# EAGLE design eps-v1-1 (EAGLE 6.1)
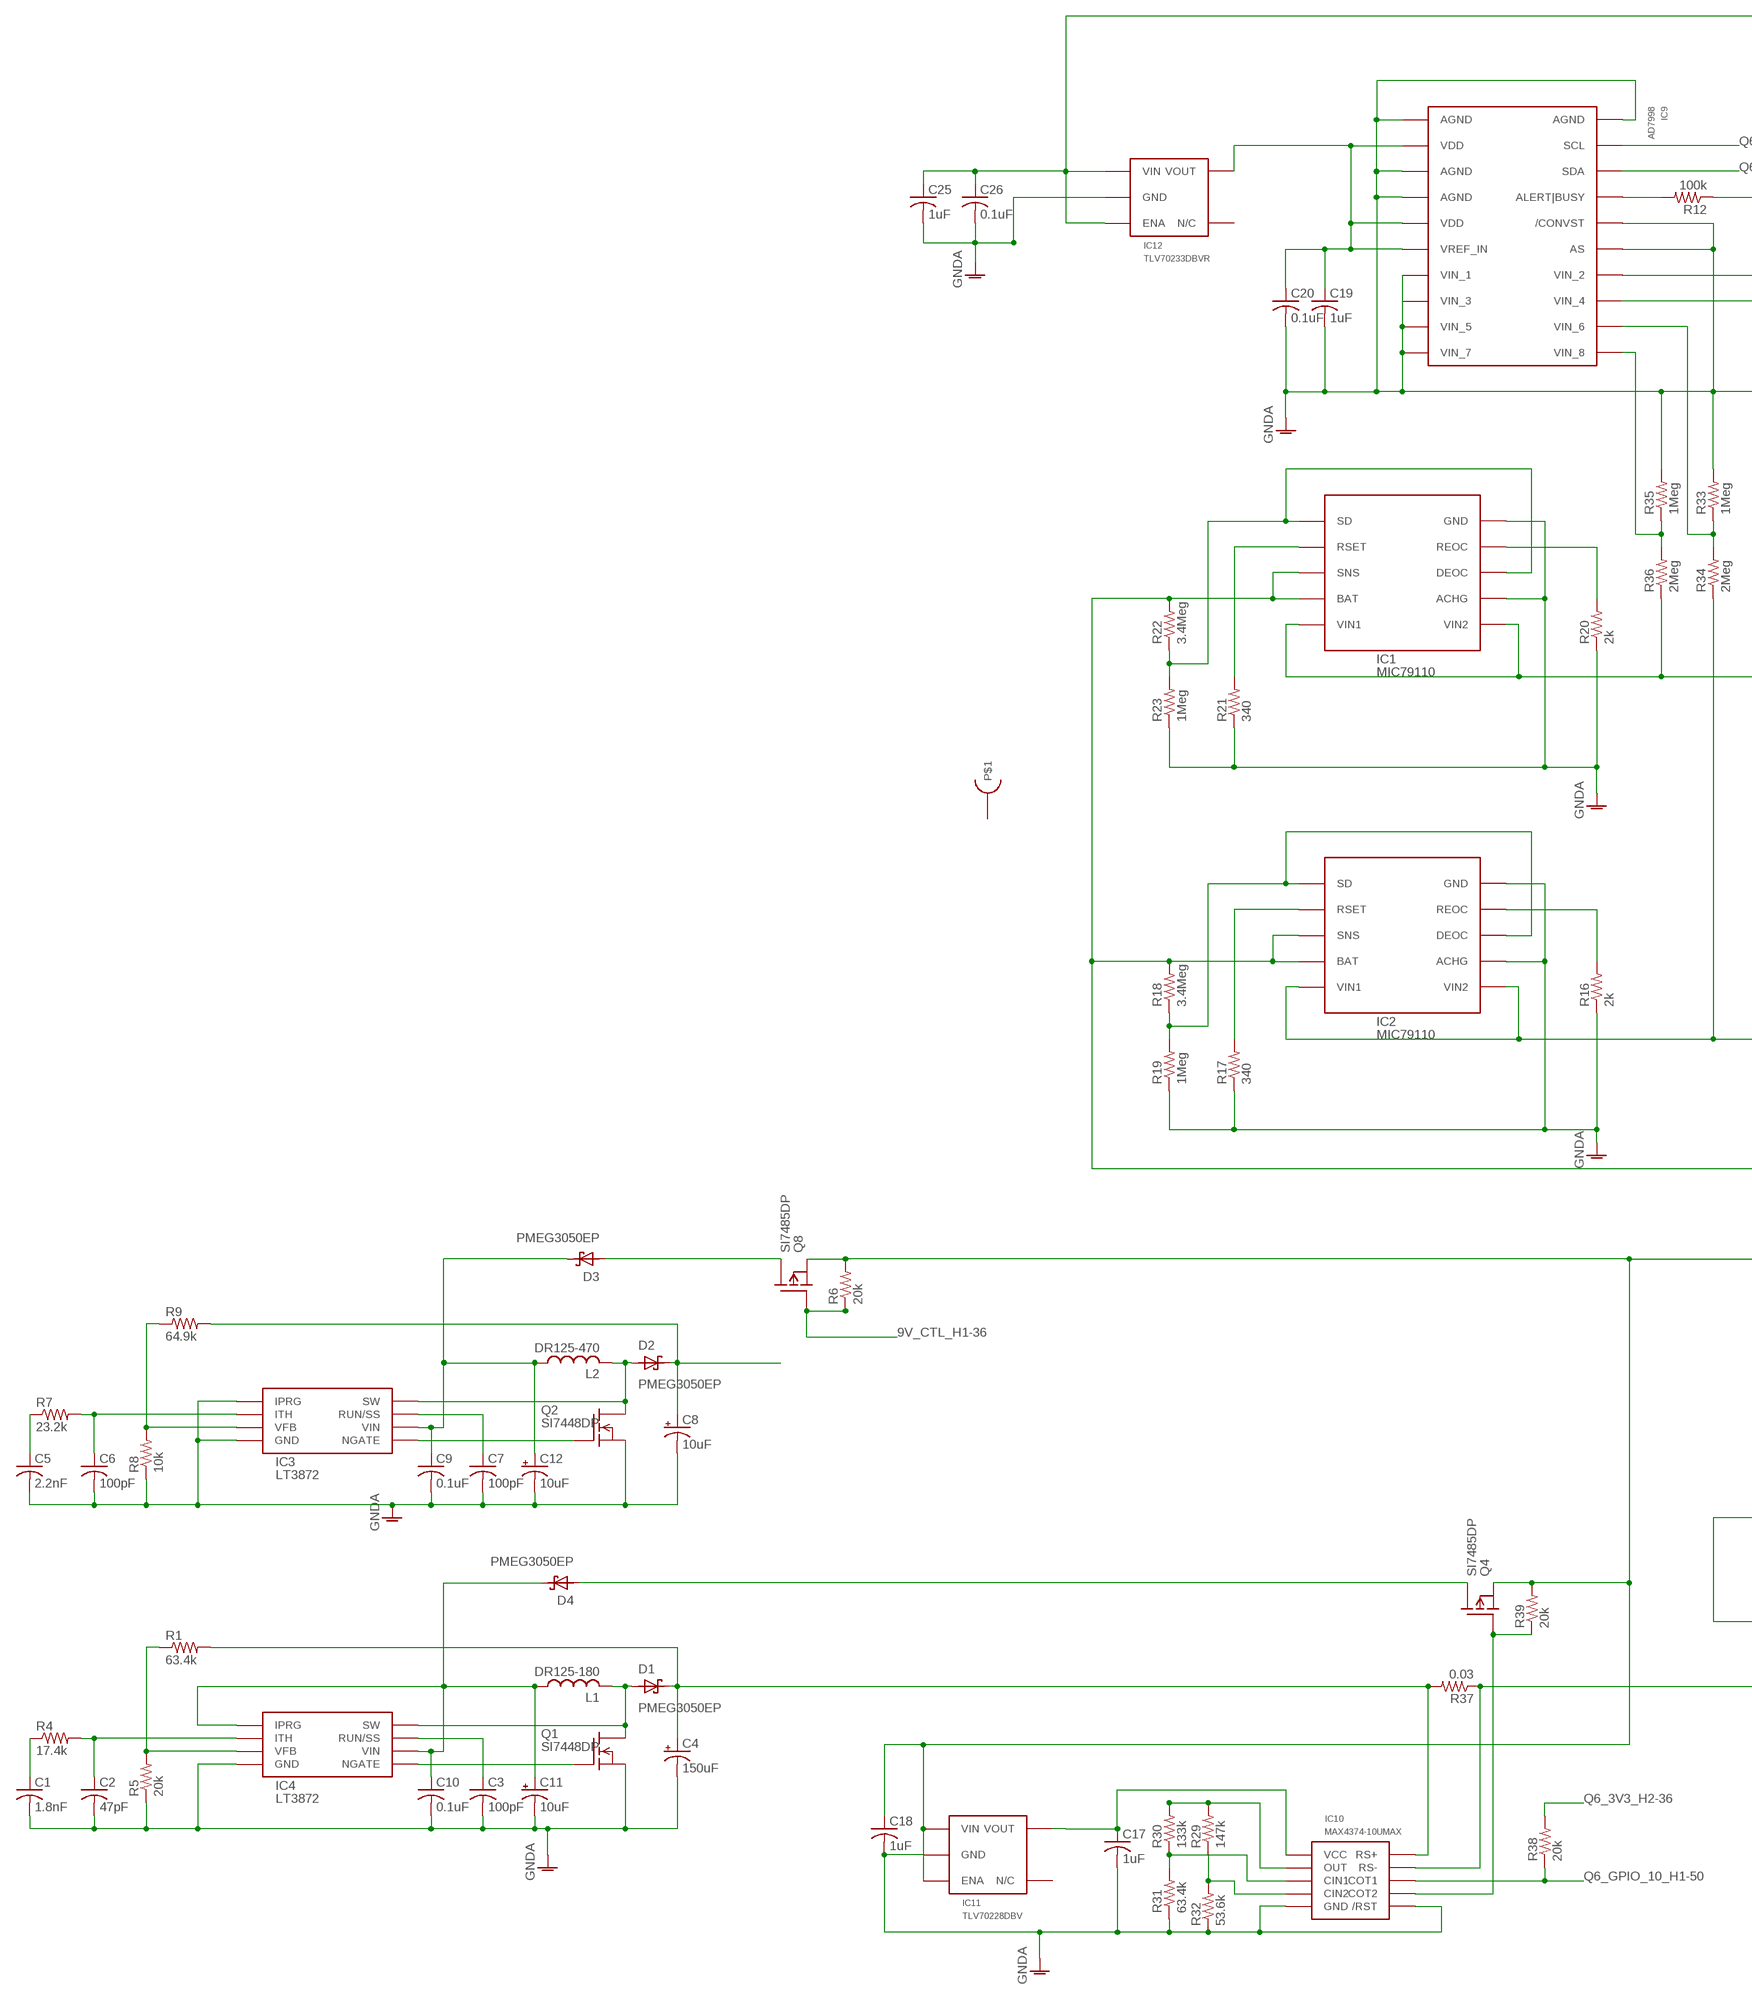
[diagram p0: schematic, sheet 1, part 1 of 2]
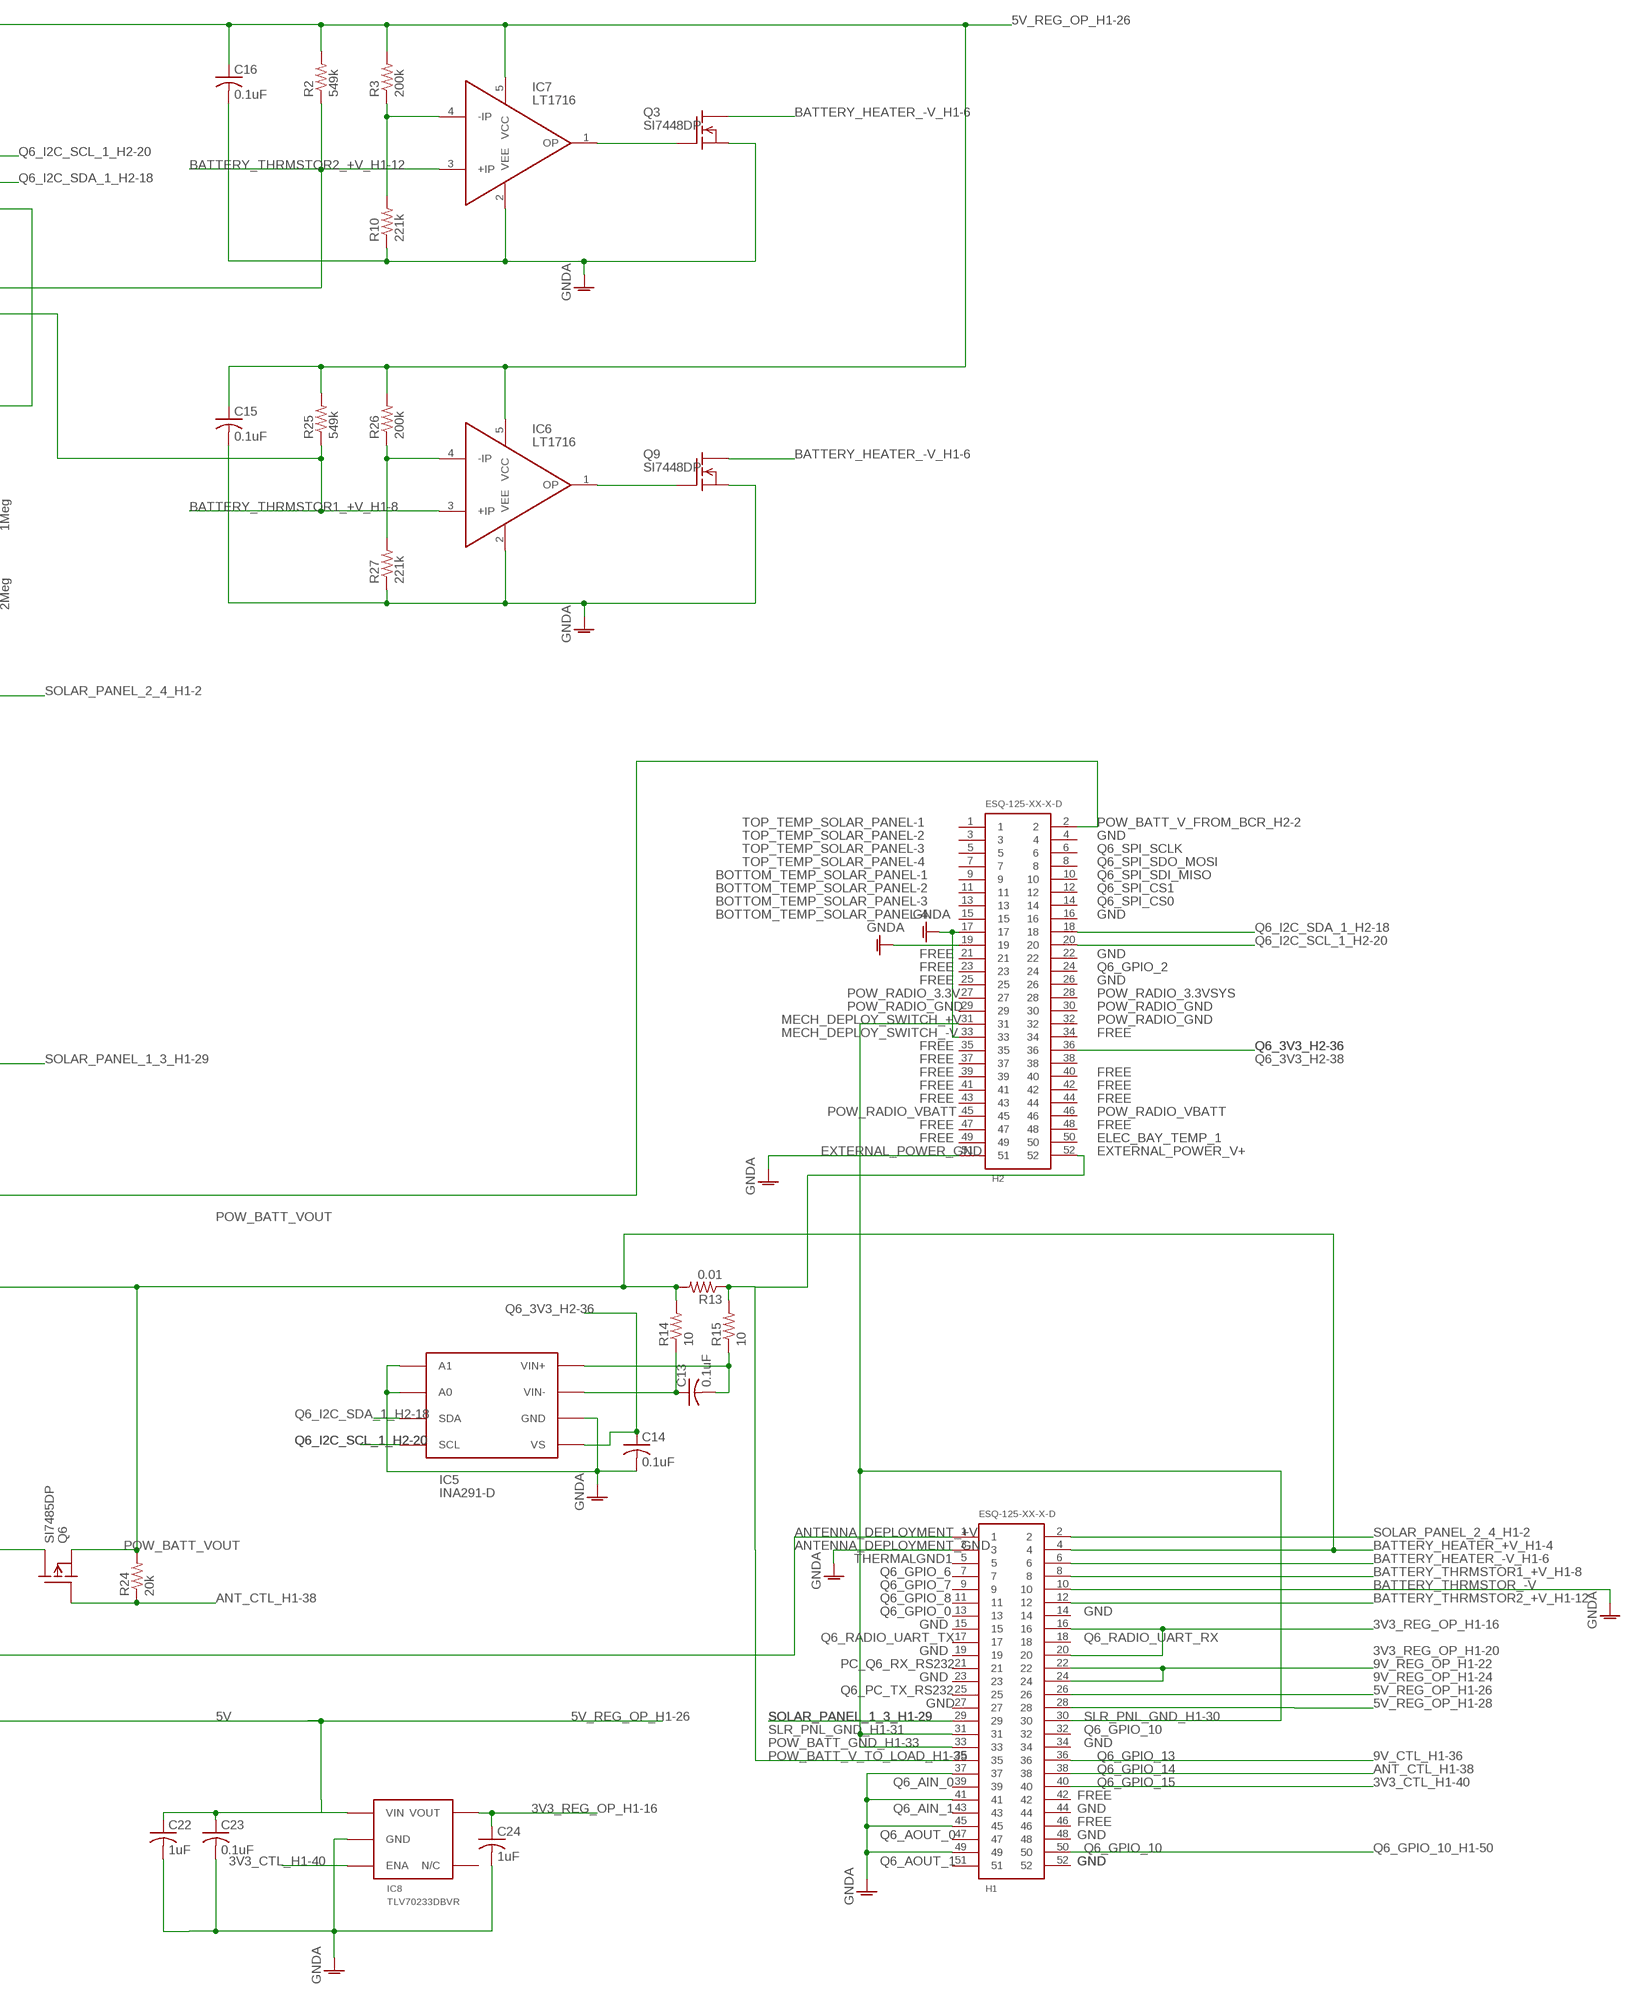
[diagram p1: schematic, sheet 1, part 2 of 2]

## Parts
C1  1.8nF  C-USC0805  [C0805]
C2  47pF  C-USC0805  [C0805]
C3  100pF  C-USC0805  [C0805]
C4  150uF  CPOL-USD/7343-31R  [D/7343-31R]
C5  2.2nF  C-USC0805  [C0805]
C6  100pF  C-USC0805  [C0805]
C7  100pF  C-USC0805  [C0805]
C8  10uF  CPOL-USD/7343-31R  [D/7343-31R]
C9  0.1uF  C-USC0805  [C0805]
C10  0.1uF  C-USC0805  [C0805]
C11  10uF  CPOL-USD/7343-31R  [D/7343-31R]
C12  10uF  CPOL-USD/7343-31R  [D/7343-31R]
C13  0.1uF  C-USC0805  [C0805]
C14  0.1uF  C-USC0805  [C0805]
C15  0.1uF  C-USC0805  [C0805]
C16  0.1uF  C-USC0805  [C0805]
C17  1uF  C-USC0805  [C0805]
C18  1uF  C-USC0805  [C0805]
C19  1uF  C-USC0805  [C0805]
C20  0.1uF  C-USC0805  [C0805]
C22  1uF  C-USC0805  [C0805]
C23  0.1uF  C-USC0805  [C0805]
C24  1uF  C-USC0805  [C0805]
C25  1uF  C-USC0805  [C0805]
C26  0.1uF  C-USC0805  [C0805]
D1  PMEG3050EP  [SOD128]
D2  PMEG3050EP  [SOD128]
D3  PMEG3050EP  [SOD128]
D4  PMEG3050EP  [SOD128]
H1  ESQ-125-XX-X-D  [ESQ-125-XX-X-D]
H2  ESQ-125-XX-X-D  [ESQ-125-XX-X-D]
IC1  MIC79110  [MLF10-EP]
IC2  MIC79110  [MLF10-EP]
IC3  LT3872  [TSOT23-8]
IC4  LT3872  [TSOT23-8]
IC5  INA291-D  [SO08]
IC6  LT1716  [SOT23-5]
IC7  LT1716  [SOT23-5]
IC8  TLV70233DBVR  [SOT23-5]
IC9  AD7998  [TSSOP-20]
IC10  MAX4374-10UMAX  [10UMAX]
IC11  TLV70228DBV  [SOT23-5]
IC12  TLV70233DBVR  [SOT23-5]
L1  DR125-180  [DR125]
L2  DR125-470  [DR125]
Q1  SI7448DP  [PPAK-SO08-EP]
Q2  SI7448DP  [PPAK-SO08-EP]
Q3  SI7448DP  [PPAK-SO08-EP]
Q4  SI7485DP  [PPAK-SO08-EP]
Q6  SI7485DP  [PPAK-SO08-EP]
Q8  SI7485DP  [PPAK-SO08-EP]
Q9  SI7448DP  [PPAK-SO08-EP]
R1  63.4k  R-US_M1206  [M1206]
R2  549k  R-US_M1206  [M1206]
R3  200k  R-US_M1206  [M1206]
R4  17.4k  R-US_M1206  [M1206]
R5  20k  R-US_M1206  [M1206]
R6  20k  R-US_M1206  [M1206]
R7  23.2k  R-US_M1206  [M1206]
R8  10k  R-US_M1206  [M1206]
R9  64.9k  R-US_M1206  [M1206]
R10  221k  R-US_M1206  [M1206]
R12  100k  R-US_M1206  [M1206]
R13  0.01  R-US_M1206  [M1206]
R14  10  R-US_M1206  [M1206]
R15  10  R-US_M1206  [M1206]
R16  2k  R-US_M1206  [M1206]
R17  340  R-US_M1206  [M1206]
R18  3.4Meg  R-US_M1206  [M1206]
R19  1Meg  R-US_M1206  [M1206]
R20  2k  R-US_M1206  [M1206]
R21  340  R-US_M1206  [M1206]
R22  3.4Meg  R-US_M1206  [M1206]
R23  1Meg  R-US_M1206  [M1206]
R24  20k  R-US_M1206  [M1206]
R25  549k  R-US_M1206  [M1206]
R26  200k  R-US_M1206  [M1206]
R27  221k  R-US_M1206  [M1206]
R29  147k  R-US_M1206  [M1206]
R30  133k  R-US_M1206  [M1206]
R31  63.4k  R-US_M1206  [M1206]
R32  53.6k  R-US_M1206  [M1206]
R33  1Meg  R-US_M1206  [M1206]
R34  2Meg  R-US_M1206  [M1206]
R35  1Meg  R-US_M1206  [M1206]
R36  2Meg  R-US_M1206  [M1206]
R37  0.03  R-US_M1206  [M1206]
R38  20k  R-US_M1206  [M1206]
R39  20k  R-US_M1206  [M1206]
U$1  EPS_PCB_THRM_PAD  [EPS_PCB_THRM_PAD]

## Nets
3V3_CTL_H1-40: H1.40 IC8.3(ENA)
3V3_REG_OP_H1-16: C24.1 H1.16 H1.20 IC8.5(VOUT)
5V_REG_OP_H1-26: C15.1 C16.1 C22.1 C23.1 C25.1 C26.1 H1.26 H1.28 IC6.5(VCC) IC7.5(VCC) IC8.1(VIN) IC10.P$9(RS-) IC12.1(VIN) IC12.3(ENA) R2.2 R3.2 R25.2 R26.2 R37.1
9V_CTL_H1-36: H1.36 Q8.P$4-G(G) R6.1
9V_REG_OP_H1-22: C8.+ D2.P$1-CATHODE H1.22 H1.24 R9.2
ANT_CTL_H1-38: H1.38 Q6.P$4-G(G) R24.1
BATTERY_HEATER_-V_H1-6: H1.6 Q3.P$5-D(D) Q3.P$6-D(D) Q3.P$7-D(D) Q3.P$8-D(D) Q3.P$9-D(D) Q3.P$10-D(D) Q3.P$11-D(D) Q9.P$5-D(D) Q9.P$6-D(D) Q9.P$7-D(D) Q9.P$8-D(D) Q9.P$9-D(D) Q9.P$10-D(D) Q9.P$11-D(D)
BATTERY_THRMSTOR1_+V_H1-8: H1.8 IC6.3(+IP) IC9.P$13(VIN_4) R25.1
BATTERY_THRMSTOR2_+V_H1-12: H1.12 IC7.3(+IP) IC9.P$14(VIN_2) R2.1
GNDA: C1.2 C2.2 C3.2 C4.- C5.2 C6.2 C7.2 C8.- C9.2 C10.2 C11.- C12.- C14.2 C15.2 C16.2 C17.2 C18.2 C19.2 C20.2 C22.2 C23.2 C24.2 C25.2 C26.2 H1.3 H1.10 H1.37 H1.41 H1.45 H1.49 H2.17 H2.19 H2.33 H2.51 IC1.P$7(ACHG) IC1.P$10(GND) IC2.P$7(ACHG) IC2.P$10(GND) IC3.P$1(IPRG) IC3.P$4(GND) IC4.P$4(GND) IC5.1(A1) IC5.2(A0) IC5.6(GND) IC6.2(VEE) IC7.2(VEE) IC8.2(GND) IC9.P$1(AGND) IC9.P$3(AGND) IC9.P$4(AGND) IC9.P$7(VIN_1) IC9.P$8(VIN_3) IC9.P$9(VIN_5) IC9.P$10(VIN_7) IC9.P$15(AS) IC9.P$16(/CONVST) IC9.P$20(AGND) IC10.P$5(GND) IC10.P$6(/RST) IC11.2(GND) IC12.2(GND) Q1.P$1-S(S) Q1.P$2-S(S) Q1.P$3-S(S) Q2.P$1-S(S) Q2.P$2-S(S) Q2.P$3-S(S) Q3.P$1-S(S) Q3.P$2-S(S) Q3.P$3-S(S) Q9.P$1-S(S) Q9.P$2-S(S) Q9.P$3-S(S) R5.1 R8.1 R10.1 R12.1 R16.1 R17.1 R19.1 R20.1 R21.1 R23.1 R27.1 R31.1 R32.1 R33.2 R35.2
N$1: IC4.P$5(NGATE) Q1.P$4-G(G)
N$2: H2.2 IC1.P$3(SNS) IC1.P$4(BAT) IC2.P$3(SNS) IC2.P$4(BAT) R18.2 R22.2
N$3: C10.1 C11.+ D4.P$1-CATHODE IC4.P$1(IPRG) IC4.P$6(VIN) L1.P$1
N$7: IC4.P$3(VFB) R1.1 R5.2
N$8: C1.1 R4.1
N$9: C2.1 IC4.P$2(ITH) R4.2
N$10: D1.P$2-ANODE IC4.P$8(SW) L1.P$2 Q1.P$5-D(D) Q1.P$6-D(D) Q1.P$7-D(D) Q1.P$8-D(D) Q1.P$9-D(D) Q1.P$10-D(D) Q1.P$11-D(D)
N$12: H1.1 Q6.P$5-D(D) Q6.P$6-D(D) Q6.P$7-D(D) Q6.P$8-D(D) Q6.P$9-D(D) Q6.P$10-D(D) Q6.P$11-D(D)
N$14: D2.P$2-ANODE IC3.P$8(SW) L2.P$2 Q2.P$5-D(D) Q2.P$6-D(D) Q2.P$7-D(D) Q2.P$8-D(D) Q2.P$9-D(D) Q2.P$10-D(D) Q2.P$11-D(D)
N$16: IC3.P$5(NGATE) Q2.P$4-G(G)
N$17: C7.1 IC3.P$7(RUN/SS)
N$18: C19.1 C20.1 IC9.P$2(VDD) IC9.P$5(VDD) IC9.P$6(VREF_IN) IC12.5(VOUT)
N$19: IC3.P$3(VFB) R8.2 R9.1
N$20: C5.1 R7.1
N$21: C6.1 IC3.P$2(ITH) R7.2
N$22: H1.30 H1.31 H1.33 H2.31
N$23: C9.1 C12.+ D3.P$1-CATHODE IC3.P$6(VIN) L2.P$1
N$24: IC9.P$11(VIN_8) R35.1 R36.2
N$25: IC2.P$2(RSET) R17.2
N$26: D3.P$2-ANODE Q8.P$5-D(D) Q8.P$6-D(D) Q8.P$7-D(D) Q8.P$8-D(D) Q8.P$9-D(D) Q8.P$10-D(D) Q8.P$11-D(D)
N$27: IC2.P$1(SD) IC2.P$8(DEOC) R18.1 R19.2
N$28: IC2.P$9(REOC) R16.2
N$29: IC1.P$2(RSET) R21.2
N$30: C4.+ D1.P$1-CATHODE IC10.P$10(RS+) R1.2 R37.2
N$31: IC1.P$1(SD) IC1.P$8(DEOC) R22.1 R23.2
N$32: IC1.P$9(REOC) R20.2
N$33: IC7.1(OP) Q3.P$4-G(G)
N$35: IC7.4(-IP) R3.1 R10.2
N$37: IC9.P$12(VIN_6) R33.1 R34.2
N$38: C13.2 IC5.8(VIN+) R15.1
N$39: D4.P$2-ANODE Q4.P$5-D(D) Q4.P$6-D(D) Q4.P$7-D(D) Q4.P$8-D(D) Q4.P$9-D(D) Q4.P$10-D(D) Q4.P$11-D(D)
N$40: C13.1 IC5.7(VIN-) R14.1
N$43: C18.1 H1.4 IC11.1(VIN) IC11.3(ENA) Q4.P$1-S(S) Q4.P$2-S(S) Q4.P$3-S(S) Q6.P$1-S(S) Q6.P$2-S(S) Q6.P$3-S(S) Q8.P$1-S(S) Q8.P$2-S(S) Q8.P$3-S(S) R6.2 R13.2 R14.2 R24.2 R39.2
N$45: IC6.1(OP) Q9.P$4-G(G)
N$46: H1.35 H2.52 R13.1 R15.2
N$47: C17.1 IC10.P$1(VCC) IC11.5(VOUT)
N$48: IC9.P$17(ALERT|BUSY) R12.2
N$51: IC10.P$2(OUT) R29.2 R30.2
N$53: IC6.4(-IP) R26.1 R27.2
N$54: IC10.P$4(CIN2) R29.1 R32.2
N$55: IC10.P$3(CIN1) R30.1 R31.2
N$56: C3.1 IC4.P$7(RUN/SS)
N$57: IC10.P$7(COT2) Q4.P$4-G(G) R39.1
Q6_3V3_H2-36: C14.1 H2.36 IC5.5(VS) R38.2
Q6_GPIO_10_H1-50: H1.50 IC10.P$8(COT1) R38.1
Q6_I2C_SCL_1_H2-20: H2.20 IC5.4(SCL) IC9.P$19(SCL)
Q6_I2C_SDA_1_H2-18: H2.18 IC5.3(SDA) IC9.P$18(SDA)
SOLAR_PANEL_1_3_H1-29: H1.29 IC2.P$5(VIN1) IC2.P$6(VIN2) R34.1
SOLAR_PANEL_2_4_H1-2: H1.2 IC1.P$5(VIN1) IC1.P$6(VIN2) R36.1
Unconnected: H1.5 H1.7 H1.9 H1.11 H1.13 H1.14 H1.15 H1.17 H1.18 H1.19 H1.21 H1.23 H1.25 H1.27 H1.32 H1.34 H1.39 H1.42 H1.43 H1.44 H1.46 H1.47 H1.48 H1.51 H1.52 H2.1 H2.3 H2.4 H2.5 H2.6 H2.7 H2.8 H2.9 H2.10 H2.11 H2.12 H2.13 H2.14 H2.15 H2.16 H2.21 H2.22 H2.23 H2.24 H2.25 H2.26 H2.27 H2.28 H2.29 H2.30 H2.32 H2.34 H2.35 H2.37 H2.38 H2.39 H2.40 H2.41 H2.42 H2.43 H2.44 H2.45 H2.46 H2.47 H2.48 H2.49 H2.50 IC8.4(N/C) IC11.4(N/C) IC12.4(N/C) U$1.P$1

## Notes on the sheet
- 5V_REG_OP_H1-26
- BATTERY_HEATER_-V_H1-6
- Q6_I2C_SCL_1_H2-20
- BATTERY_THRMSTOR2_+V_H1-12
- Q6_I2C_SDA_1_H2-18
- BATTERY_HEATER_-V_H1-6
- BATTERY_THRMSTOR1_+V_H1-8
- SOLAR_PANEL_2_4_H1-2
- TOP_TEMP_SOLAR_PANEL-1 | POW_BATT_V_FROM_BCR_H2-2
- TOP_TEMP_SOLAR_PANEL-2 | GND
- TOP_TEMP_SOLAR_PANEL-3 | Q6_SPI_SCLK
- TOP_TEMP_SOLAR_PANEL-4 | Q6_SPI_SDO_MOSI
- BOTTOM_TEMP_SOLAR_PANEL-1 | Q6_SPI_SDI_MISO
- BOTTOM_TEMP_SOLAR_PANEL-2 | Q6_SPI_CS1
- BOTTOM_TEMP_SOLAR_PANEL-3 | Q6_SPI_CS0
- BOTTOM_TEMP_SOLAR_PANEL-4 | GND
- Q6_I2C_SDA_1_H2-18
- Q6_I2C_SCL_1_H2-20
- FREE | GND
- FREE | Q6_GPIO_2
- FREE | GND
- POW_RADIO_3.3V | POW_RADIO_3.3VSYS
- POW_RADIO_GND | POW_RADIO_GND
- MECH_DEPLOY_SWITCH_+V | POW_RADIO_GND
- MECH_DEPLOY_SWITCH_-V | FREE
- FREE | Q6_3V3_H2-36 | Q6_3V3_H2-36
- SOLAR_PANEL_1_3_H1-29 | FREE | Q6_3V3_H2-38
- FREE | FREE
- FREE | FREE
- FREE | FREE
- POW_RADIO_VBATT | POW_RADIO_VBATT
- FREE | FREE
- FREE | ELEC_BAY_TEMP_1
- EXTERNAL_POWER_GND | EXTERNAL_POWER_V+
- POW_BATT_VOUT
- Q6_3V3_H2-36
- 9V_CTL_H1-36
- Q6_I2C_SDA_1_H2-18
- Q6_I2C_SCL_1_H2-20 | Q6_I2C_SCL_1_H2-20
- ANTENNA_DEPLOYMENT_+V | SOLAR_PANEL_2_4_H1-2
- POW_BATT_VOUT | ANTENNA_DEPLOYMENT_GND | BATTERY_HEATER_+V_H1-4
- THERMALGND1 | BATTERY_HEATER_-V_H1-6
- Q6_GPIO_6 | BATTERY_THRMSTOR1_+V_H1-8
- Q6_GPIO_7 | BATTERY_THRMSTOR_-V
- ANT_CTL_H1-38 | Q6_GPIO_8 | BATTERY_THRMSTOR2_+V_H1-12
- Q6_GPIO_0 | GND
- GND | 3V3_REG_OP_H1-16
- Q6_RADIO_UART_TX | Q6_RADIO_UART_RX
- GND | 3V3_REG_OP_H1-20
- PC_Q6_RX_RS232 | 9V_REG_OP_H1-22
- GND | 9V_REG_OP_H1-24
- Q6_PC_TX_RS232 | 5V_REG_OP_H1-26
- GND | 5V_REG_OP_H1-28
- 5V | 5V_REG_OP_H1-26 | SOLAR_PANEL_1_3_H1-29 | SOLAR_PANEL_1_3_H1-29 | SLR_PNL_GND_H1-30
- SLR_PNL_GND_H1-31 | Q6_GPIO_10
- POW_BATT_GND_H1-33 | GND
- POW_BATT_V_TO_LOAD_H1-35 | Q6_GPIO_13 | 9V_CTL_H1-36
- Q6_GPIO_14 | ANT_CTL_H1-38
- Q6_AIN_0 | Q6_GPIO_15 | 3V3_CTL_H1-40
- FREE
- 3V3_REG_OP_H1-16 | Q6_AIN_1 | GND
- FREE
- Q6_3V3_H2-36 | Q6_AOUT_0 | GND
- Q6_GPIO_10 | Q6_GPIO_10_H1-50
- 3V3_CTL_H1-40 | Q6_AOUT_1 | GND | GND
- Q6_GPIO_10_H1-50

## Library data of the parts
C1-C3 C5-C7 C9 C10 C13-C20 C22-C26 = rcl:C-US: CAPACITOR, American symbol
C4 C8 C11 C12 = rcl:CPOL-US: POLARIZED CAPACITOR, American symbol
D1-D4 = space-concordia-power:PMEG3050EP: PMEG3050EP 30V 5A SMD Schottky barrier diode SOD128 package Manufacturer: NXP
H1 H2 = ESQ-126-XX-X-D:ESQ-125-XX-X-D: ELEVATED SOCKET, .100 inch(2.54mm) PITCH
IC1 IC2 = space-concordia-power:MIC79110: Micrel 79110 Description: Simple 1.2A Li-Ion BCR Package: MLF-10 (QFN-10) Exposed Pad
IC3 IC4 = space-concordia-power:LT3872: Linear Technologies LT3872 Boost Regulator
IC5 = space-concordia-power:INA291-D: INA219-DCN voltage/current/power monitor with I2C interface SO-8 package
IC6 IC7 = space-concordia-power:LT1716: LT1716 Rail-to-Rail Comparator SOT-23, 44V, Over-the-Top, Micropower, Precision Rail-to-Rail Comparator
IC8 IC12 = space-concordia-power:TLV70233DBVR: TLV70233 LDO Regulator Texas Instruments 2% Precision 3.3V fixed output Imax: 300mA Package: SOT23-5
IC9 = space-concordia-power:AD7998: AD7998 8 Channel, 10bit, I2C ADCs TSSOP-20 Pkg
IC10 = space-concordia-power:MAX4374-10UMAX: MAX4373 Low power, High side, Rsense current comparator active high, latchable output 10uMAX package
IC11 = space-concordia-power:TLV70228DBV: TLV70228 LDO Regulator Texas Instruments 2% Precision 2.8V fixed output Imax: 300mA Package: SOT23-5
L1 = space-concordia-power:DR125-180: DR125-180 18uH, 3.81A, ferrite core, SMD Power Inductor 12.6mm x 12.6mm x 6mm made by Cooper Bussmann
L2 = space-concordia-power:DR125-470: DR125-180 47uH, 2.71A, ferrite core, SMD Power Inductor 12.6mm x 12.6mm x 6mm made by Cooper Bussmann
Q1-Q3 Q9 = space-concordia-power:SI7448DP: Si7448DP 20V n-channel MOSFET PPAK SO8 Vishay Siliconix
Q4 Q6 Q8 = space-concordia-power:SI7485DP: Si7485DP 20V p-channel MOSFET PPAK SO8 Vishay Siliconix
R1-R10 R12-R27 R29-R39 = resistor:R-US_: RESISTOR, American symbol
U$1 = space-concordia-power:EPS_PCB_THRM_PAD: Consat-1 EPS PCB Thermal Pad A symbol for the thermal SMD pads of the EPS thermal pad. This pad must be placed directly on an edge of the board, close to the BCRs, so that it can transfer heat from the PCB thermal layers to the chassis. dim: 60mm x 4mm

## Board
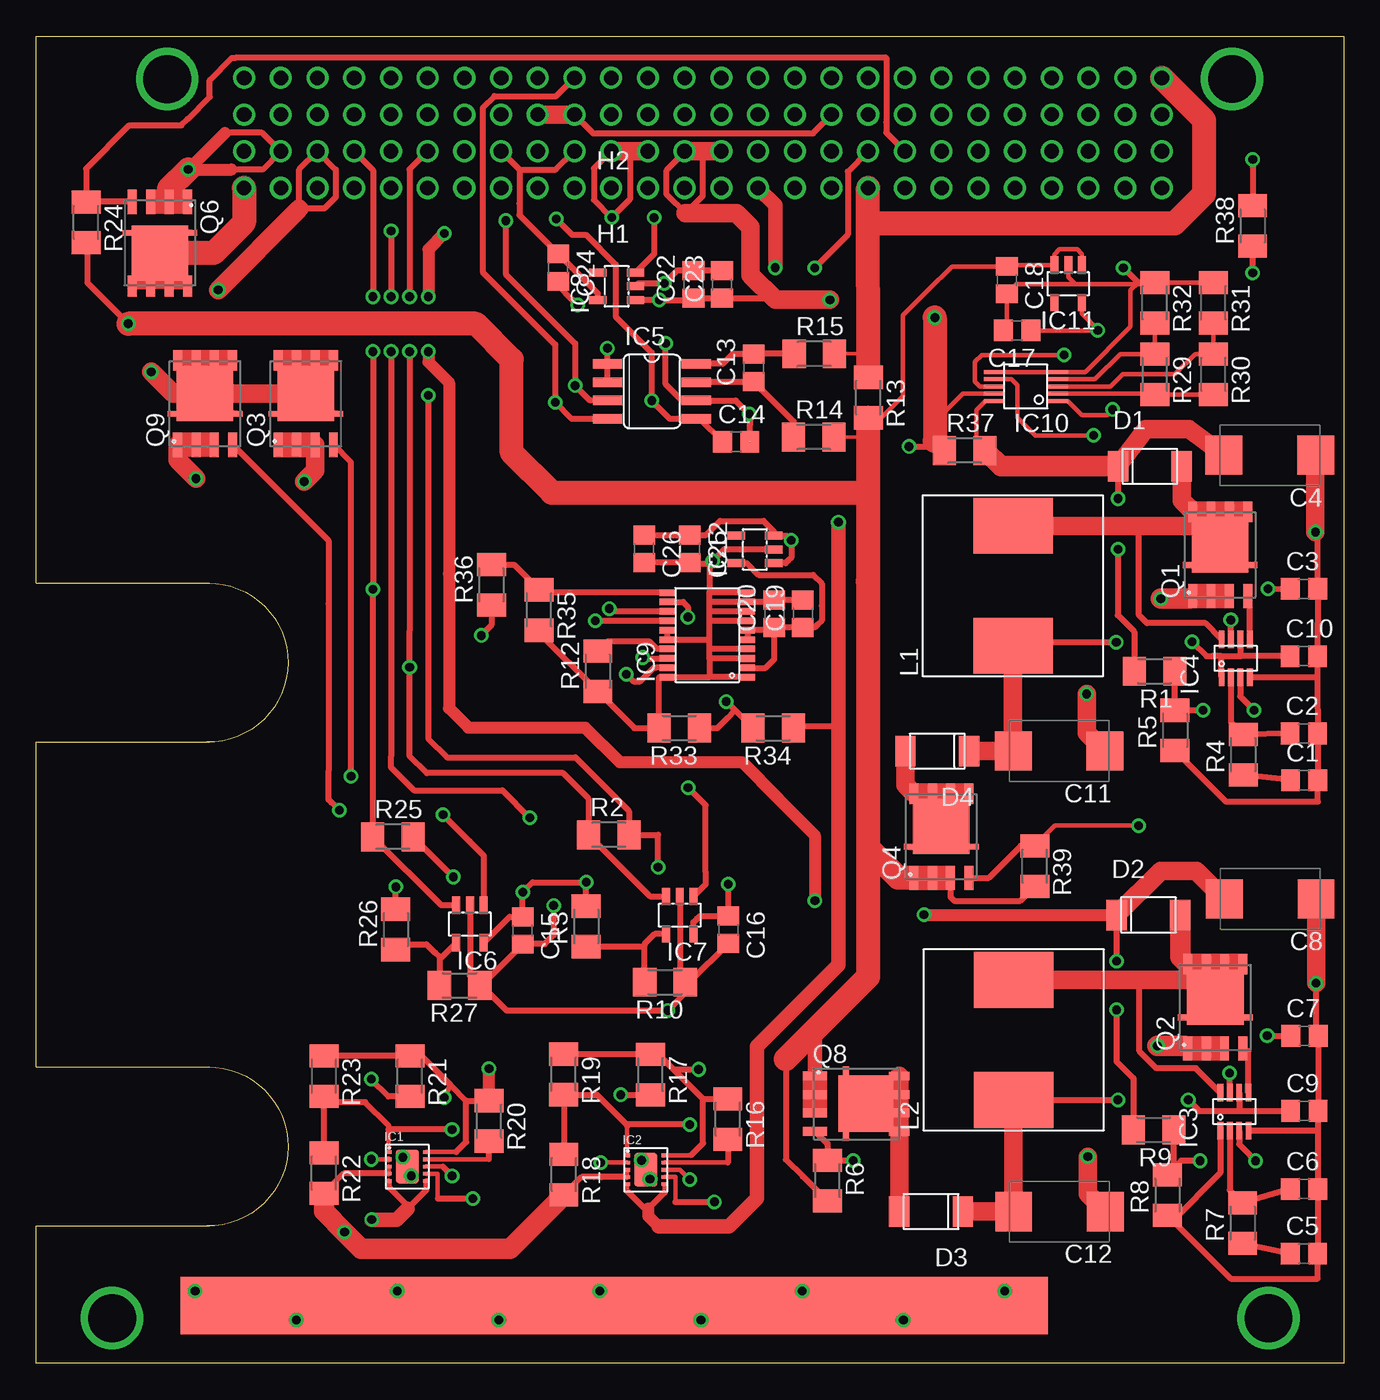
[diagram p2: board, top side]
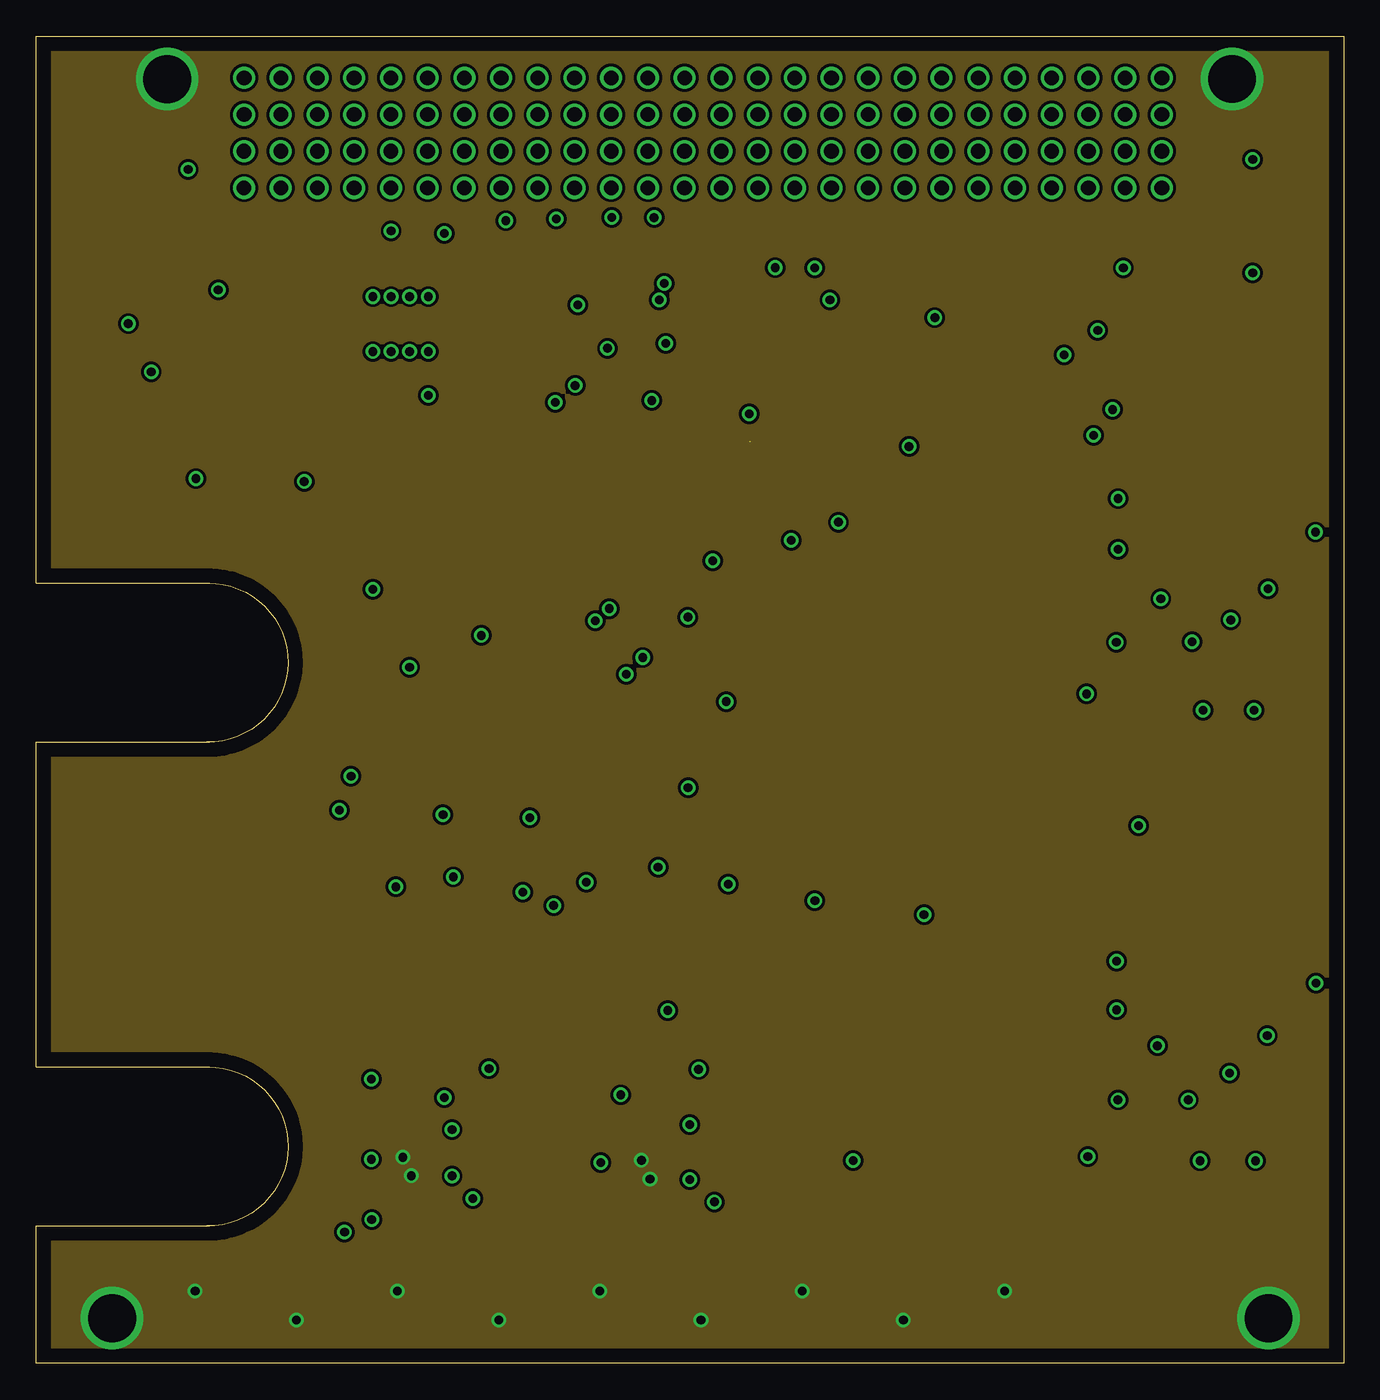
[diagram p3: board, inner layer Route2]
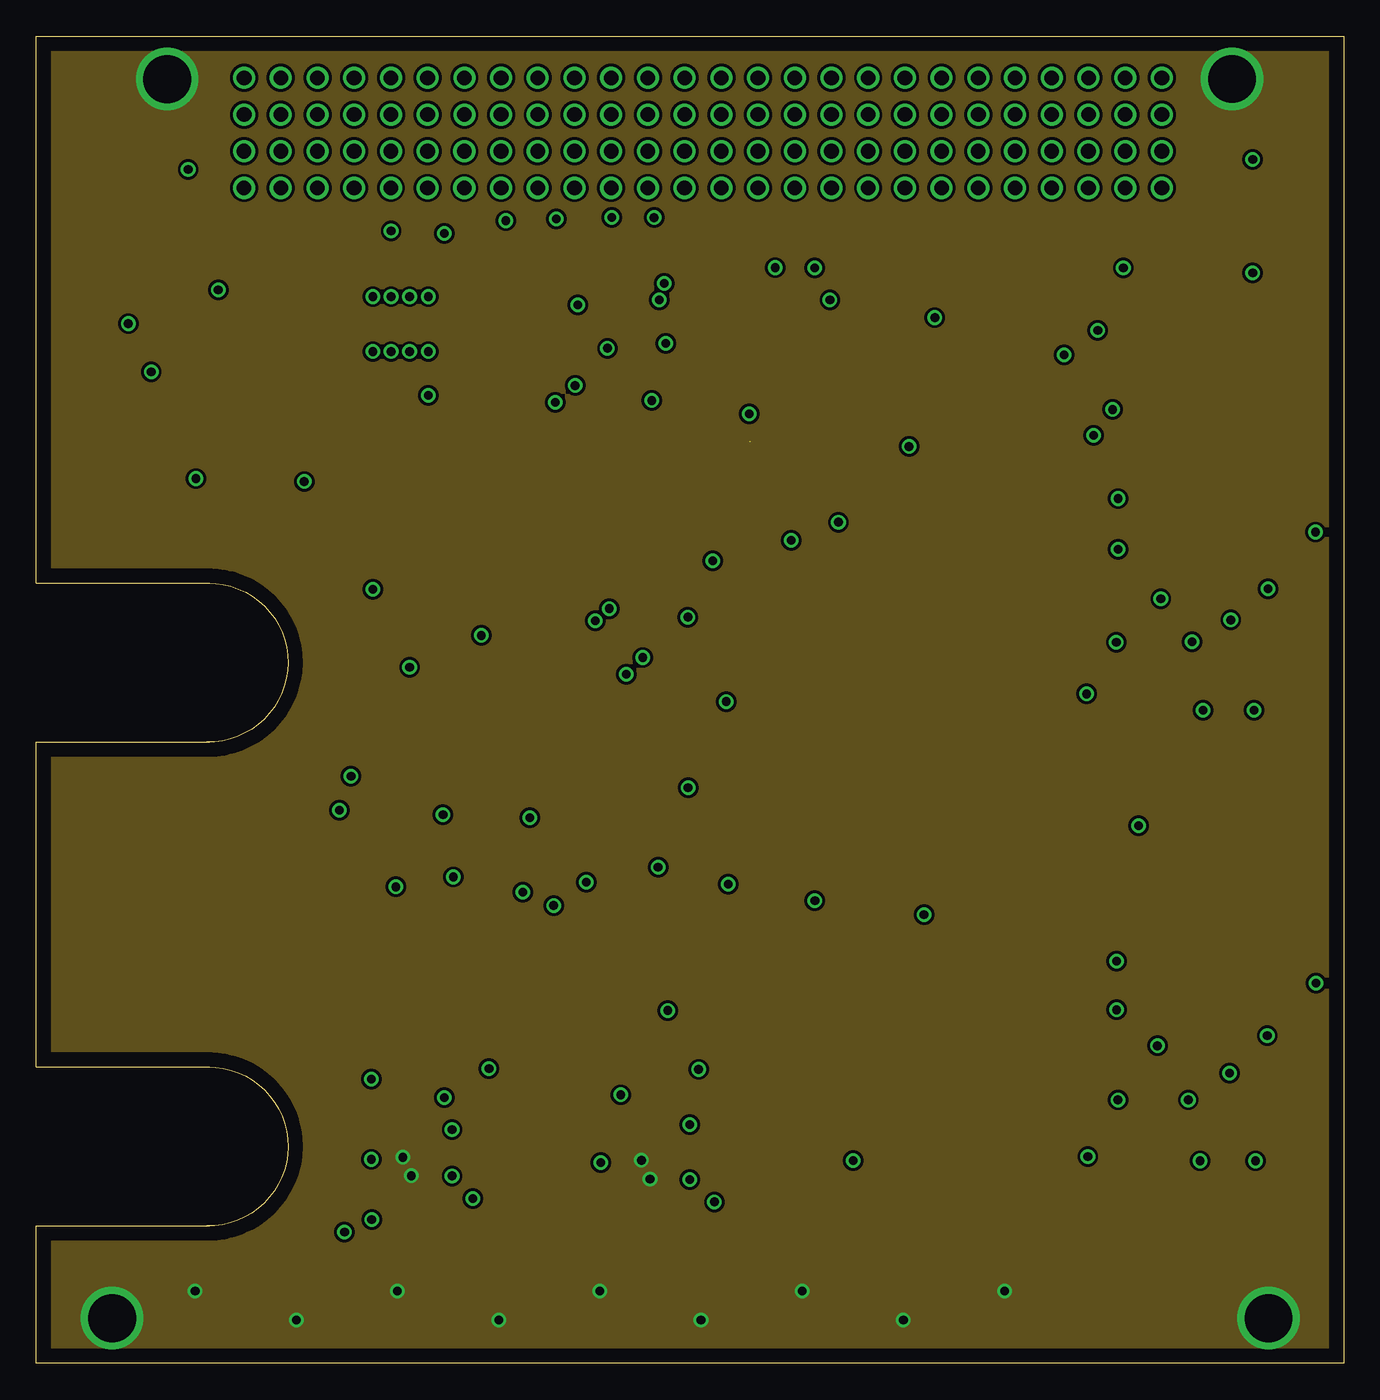
[diagram p4: board, inner layer Route15]
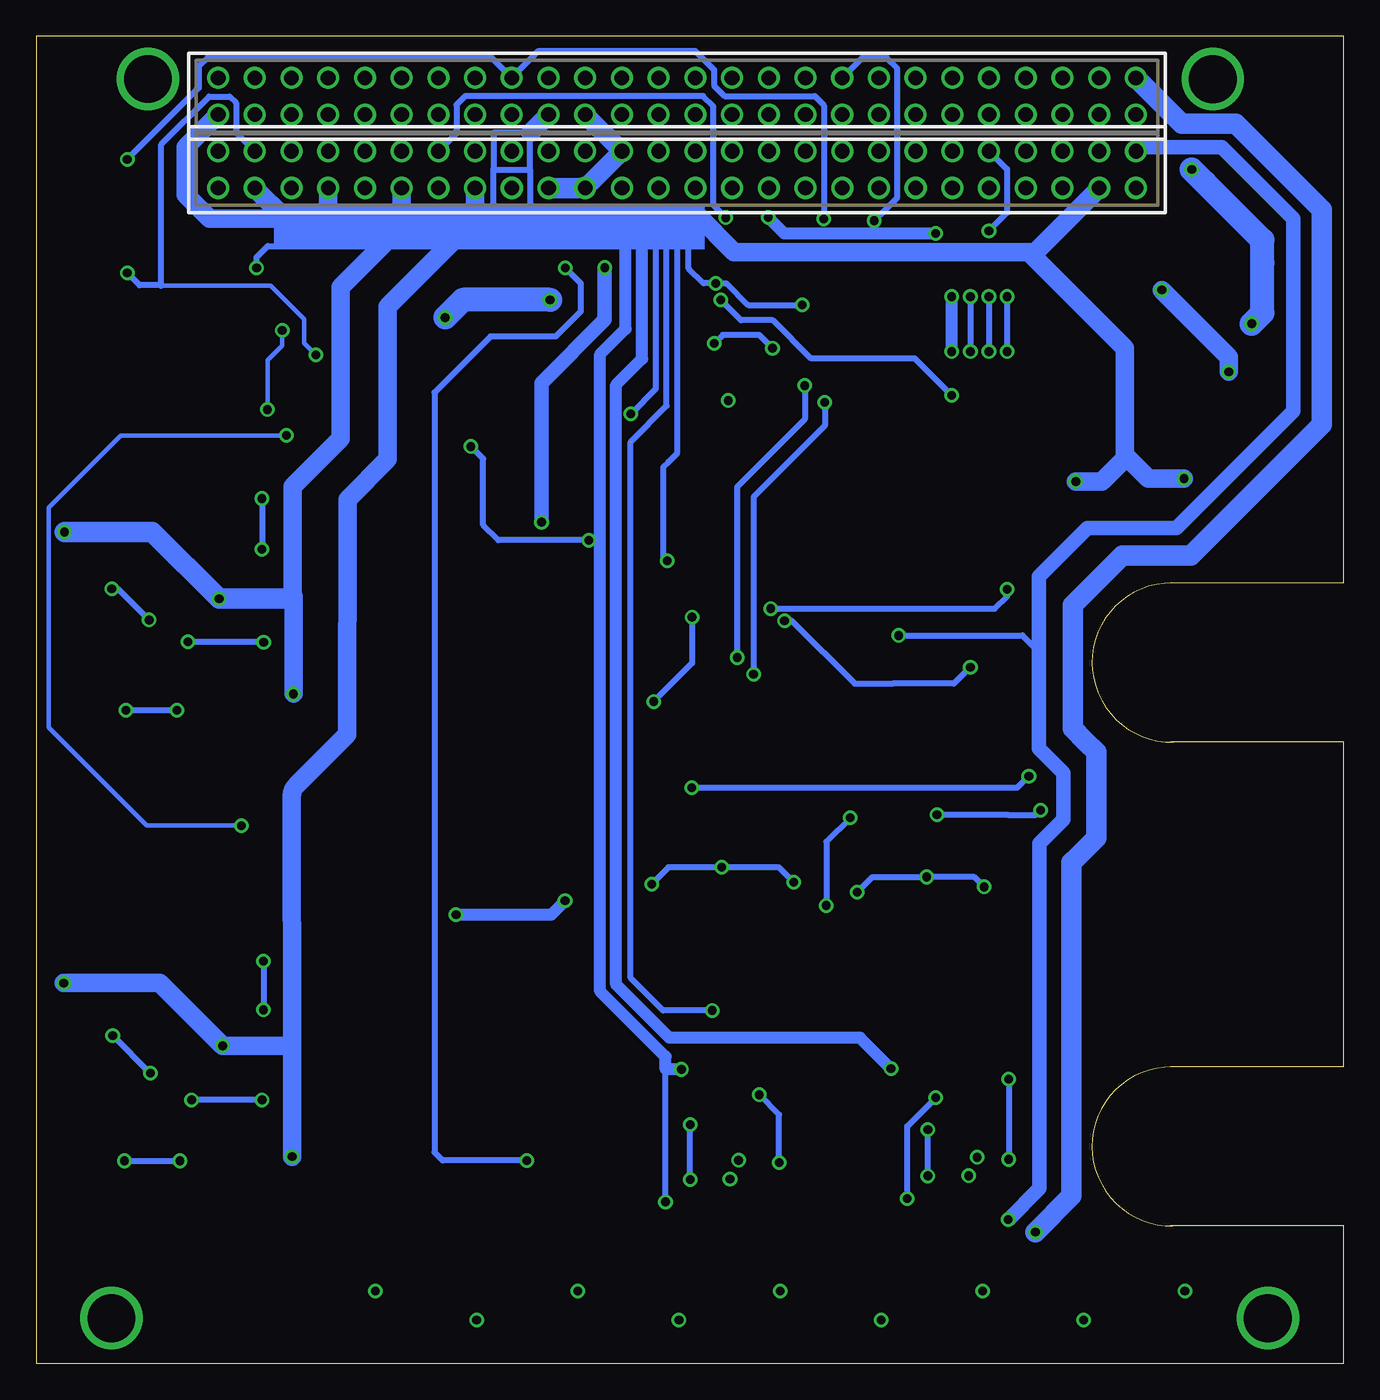
[diagram p5: board, bottom side, seen from below]

Size 90.47 x 91.83 mm. Coordinates in mm from the lower left corner, seen from the top.
Outline: 12,9.5 0,9.5 0,0 90.47,0 90.47,91.83 0,91.83 0,54 12,54
Outline: 12,20.5 0,20.5 0,43 12,43
Outline: 11.86,53.99 arc-182 11.81,42.99
Outline: 11.87,20.51 arc-182 11.81,9.51
Copper layers (1*2*15*16): Top 0.035mm / dielectric 1.5mm / Route2 0.035mm / dielectric 0.15mm / Route15 0.035mm / dielectric 0.2mm / Bottom 0.035mm
Design rules: minimum track width 10mil, minimum drill 24mil, track to track 8mil, track to pad 8mil, pad to pad 8mil, via to via 8mil, smd to smd 8mil, copper to edge 40mil, drill to drill 8mil, minimum pad ring 10mil, minimum via ring 8mil, stop-mask expansion 4mil, vias tented up to drill 0mil, thermal gap 10mil

### Footprints (pad centres in the part's own frame; a part is rotated, then mirrored left to right if it is on the bottom)
C0805 = smd 1.3 x 1.5: 1 -0.95,0; 2 0.95,0
D/7343-31R = smd 2.55 x 2.7: + 3.175,0; - -3.175,0
SOD128 = smd 1.4 x 2.1: P$1-CATHODE -2.2,0; P$2-ANODE 2.2,0
ESQ-125-XX-X-D = drill 1.016 pad 1.524: 1 -27.94,-1.27; 2 -27.94,1.27; 3 -25.4,-1.27; 4 -25.4,1.27; 5 -22.86,-1.27; 6 -22.86,1.27; 7 -20.32,-1.27; 8 -20.32,1.27; 9 -17.78,-1.27; 10 -17.78,1.27; 11 -15.24,-1.27; 12 -15.24,1.27; 13 -12.7,-1.27; 14 -12.7,1.27; 15 -10.16,-1.27; 16 -10.16,1.27; 17 -7.62,-1.27; 18 -7.62,1.27; 19 -5.08,-1.27; 20 -5.08,1.27; 21 -2.54,-1.27; 22 -2.54,1.27; 23 0,-1.27; 24 0,1.27; 25 2.54,-1.27; 26 2.54,1.27; 27 5.08,-1.27; 28 5.08,1.27; 29 7.62,-1.27; 30 7.62,1.27; 31 10.16,-1.27; 32 10.16,1.27; 33 12.7,-1.27; 34 12.7,1.27; 35 15.24,-1.27; 36 15.24,1.27; 37 17.78,-1.27; 38 17.78,1.27; 39 20.32,-1.27; 40 20.32,1.27; 41 22.86,-1.27; 42 22.86,1.27; 43 25.4,-1.27; 44 25.4,1.27; 45 27.94,-1.27; 46 27.94,1.27; 47 30.48,-1.27; 48 30.48,1.27; 49 33.02,-1.27; 50 33.02,1.27; 51 35.56,-1.27; 52 35.56,1.27
MLF10-EP = smd 0.4 x 0.25: P$1 -1.3,1; P$2 -1.3,0.5; P$3 -1.3,0; P$4 -1.3,-0.5; P$5 -1.3,-1; P$6 1.3,-1; P$7 1.3,-0.5; P$8 1.3,0; P$9 1.3,0.5; P$10 1.3,1 | smd 1.6 x 2.3: P$11 0,0
TSOT23-8 = smd 0.4 x 1.22: P$1 -0.975,-1.31; P$2 -0.325,-1.31; P$3 0.325,-1.31; P$4 0.975,-1.31; P$5 0.975,1.31; P$6 0.325,1.31; P$7 -0.325,1.31; P$8 -0.975,1.31
SO08 = smd 0.66 x 2.032: 1 -1.905,-3.073; 2 -0.635,-3.073; 3 0.635,-3.073; 4 1.905,-3.073; 5 1.905,3.073; 6 0.635,3.073; 7 -0.635,3.073; 8 -1.905,3.073
SOT23-5 = smd 0.55 x 1.2: 1 -0.95,-1.3; 2 0,-1.3; 3 0.95,-1.3; 4 0.95,1.3; 5 -0.95,1.3
TSSOP-20 = smd 0.45 x 1.05: P$1 -2.925,-2.775; P$2 -2.275,-2.775; P$3 -1.635,-2.775; P$4 -0.975,-2.775; P$5 -0.325,-2.775; P$6 0.325,-2.775; P$7 0.975,-2.775; P$8 1.625,-2.775; P$9 2.275,-2.775; P$10 2.925,-2.775; P$11 2.925,2.775; P$12 2.275,2.775; P$13 1.625,2.775; P$14 0.975,2.775; P$15 0.325,2.775; P$16 -0.325,2.775; P$17 -0.975,2.775; P$18 -1.625,2.775; P$19 -2.275,2.775; P$20 -2.925,2.775
10UMAX = smd 1.4 x 0.28: P$1 -2.2,1; P$2 -2.2,0.5; P$3 -2.2,0; P$4 -2.2,-0.5; P$5 -2.2,-1; P$6 2.2,-1; P$7 2.2,-0.5; P$8 2.2,0; P$9 2.2,0.5; P$10 2.2,1
DR125 = smd 3.85 x 5.5: P$1 -4.15,0; P$2 4.15,0
PPAK-SO08-EP = smd 1.67 x 0.61: P$1-S -2.85,1.91; P$2-S -2.85,0.63; P$3-S -2.85,-0.635; P$4-G -2.85,-1.91 | smd 1.42 x 0.61: P$5-D 2.98,-1.91; P$6-D 2.98,-0.635; P$7-D 2.98,0.63; P$8-D 2.98,1.91 | smd 3.81 x 3.91: P$9-D 0.69,0 | smd 0.4 x 0.7: P$10-D -0.705,2.23; P$11-D -0.705,-2.23
M1206 = smd 1.6 x 2: 1 -1.4,0; 2 1.4,0
EPS_PCB_THRM_PAD = smd 60 x 4: P$1 0,0

### Placement (x,y rotation side)
C1  87.73,40.35 0 top
C2  87.7,43.58 0 top
C3  87.72,53.58 0 top
C4  85.35,62.83 180 top
C5  87.71,7.6 0 top
C6  87.73,12.06 0 top
C7  87.75,22.65 0 top
C8  85.38,32.14 180 top
C9  87.74,17.47 0 top
C10  87.7,48.93 0 top
C11  70.78,42.36 180 top
C12  70.8,10.5 180 top
C13  49.65,68.88 90 top
C14  48.43,63.76 0 top
C15  33.67,29.95 270 top
C16  47.89,30 270 top
C17  67.87,71.46 180 top
C18  67.16,74.94 270 top
C19  53.04,51.87 90 top
C20  51.07,51.87 90 top
C22  45.48,74.65 90 top
C23  47.45,74.64 90 top
C24  36.12,75.81 270 top
C25  45.23,56.36 270 top
C26  42.07,56.36 270 top
D1  77.05,62.07 0 top
D2  76.95,31.02 0 top
D3  61.92,10.51 180 top
D4  62.35,42.36 180 top
H1  42.32,82.59 0 top
H2  42.33,87.67 0 top
IC1  25.68,13.62 0 top
IC2  42.18,13.39 0 top
IC3  82.9,17.42 0 top
IC4  82.99,48.78 0 top
IC5  42.6,67.25 270 top
IC6  30.01,30.4 180 top
IC7  44.53,31.01 180 top
IC8  40.17,74.52 90 top
IC9  46.43,50.4 90 top
IC10  68.47,67.58 180 top
IC11  71.41,74.69 180 top
IC12  49.73,56.31 90 top
L1  67.58,53.79 90 top
L2  67.63,22.38 90 top
Q1  81.92,55.94 90 top
Q2  81.58,24.64 90 top
Q3  18.66,66.4 90 top
Q4  62.63,36.45 90 top
Q6  8.57,77.51 270 top
Q8  56.73,17.96 0 top
Q9  11.69,66.4 90 top
R1  77.38,47.89 180 top
R2  39.61,36.57 0 top
R3  38.05,30.23 90 top
R4  83.51,42.11 90 top
R5  78.79,43.79 90 top
R6  54.75,12.64 270 top
R7  83.47,9.7 90 top
R8  78.26,11.64 90 top
R9  77.32,16.15 180 top
R10  43.51,26.38 180 top
R12  38.86,47.88 90 top
R13  57.57,66.82 270 top
R14  53.81,64.08 0 top
R15  53.84,69.84 0 top
R16  47.85,16.91 270 top
R17  42.51,19.99 270 top
R18  36.51,13.07 270 top
R19  36.49,20 270 top
R20  31.33,16.78 270 top
R21  25.86,19.86 270 top
R22  19.92,13.16 270 top
R23  19.92,19.87 270 top
R24  3.46,78.94 270 top
R25  24.69,36.43 0 top
R26  24.88,30.02 90 top
R27  29.3,26.15 180 top
R29  77.39,68.43 270 top
R30  81.45,68.43 270 top
R31  81.45,73.37 270 top
R32  77.39,73.37 270 top
R33  44.51,43.95 180 top
R34  51,43.95 180 top
R35  34.8,52.12 270 top
R36  31.5,53.86 90 top
R37  64.25,63.15 0 top
R38  84.16,78.69 90 top
R39  69.09,34.4 270 top
U$1  40,4 0 top

### Tracks (layer width: path | path; a pad name or v marks a point on that pad's centre or on a via)
3V3_CTL_H1-40  (via drill 0.6)
  Top 0.406: v42.75,79.27 42.75,77.14 42.75,76.76 IC8.3
  Bottom 0.406: v42.75,79.27 43.62,80.14 43.62,86.97 44.32,87.67 60.79,87.67 61.4,87.07 61.4,85.11 H1.40
3V3_REG_OP_H1-16
  Top 0.406: H1.16 33.43,82.6 | 33.43,82.6 35.94,82.6 H1.20 | 33.43,82.6 33.44,82.59 33.44,80.24 33.44,79.44 C24.1 38.87,74.01 IC8.5
5V_REG_OP_H1-26  (via drill 0.6)
  Top 0.305: 62.85,65.81 64.12,67.08 IC10.P$9 | 62.18,63.82 R37.1
  Top 0.406: v47.89,33.15 C16.1 45.92,30.95 45.72,30.75 45.48,30.51 IC7.5 | v43.03,34.32 43.03,36.57 R2.2 41.02,38.21 37.3,41.93 28.42,41.93 27.13,43.21 v27.13,66.96 | R3.2 v38.05,33.29 34.35,33.29 v33.67,32.6 C15.1 32.76,30.9 IC6.5 | R26.2 v24.88,32.97 | 46.14,83.86 46.14,80.78 44.92,79.57 43.62,80.87 43.62,82.55 44.86,83.79 H1.26 | R37.1 62.85,65.81 | v43.11,73.57 arc90 v43.11,73.57 | v43.11,73.57 IC8.1 | v43.11,73.57 45.35,73.57 C22.1 C23.1 51.17,73.69 51.28,73.58 | IC12.1 51.86,55.36 52.03,55.53 52.25,55.75 v52.25,56.95 51.94,57.26 IC12.3 51.03,57.58 50.33,58.28 47.33,58.28 46.88,57.83 46.36,57.31 C25.1 C26.1 | v60.39,63.43 61.78,63.43 62.18,63.82 | R25.2 28.86,33.66 v28.86,33.65
  Top 1.27: v54.92,73.58 51.28,73.58 51.14,73.58 49.42,75.3 49.42,78.6 48.45,79.57 44.92,79.57 | H1.28 H1.26
  Top 1.676: v62.18,72.35 62.18,63.82
  Bottom 0.406: v47.89,33.15 46.72,34.32 46.7,34.32 | 46.7,34.32 v43.03,34.32 39.09,34.32 v38.05,33.29 | 46.7,34.32 46.71,34.31 | v33.67,32.6 32.62,33.65 v28.86,33.65 25.57,33.65 v24.88,32.97 | v27.13,66.96 29.69,69.52 36.86,69.52 39.5,72.16 41.7,72.16 v43.11,73.57 | v52.25,56.95 58.49,56.95 59.55,58.01 59.55,62.59 v60.39,63.43
  Bottom 1.676: v54.92,73.58 60.95,73.58 v62.18,72.35
9V_CTL_H1-36  (via drill 0.6)
  Top 0.406: v53.87,75.8 56.16,78.09 56.16,82.46 H1.36 | v56.52,14.04 R6.1 54.75,15.19 Q8.P$4-G
  Bottom 0.406: v53.87,75.8 52.79,74.72 52.79,72.77 54.52,71.04 59.05,71.04 62.91,67.18 62.91,14.61 62.34,14.04 v56.52,14.04
9V_REG_OP_H1-22  (via drill 0.6)
  Top 0.406: D2.P$1-CATHODE v74.75,27.82 | v74.75,24.46 74.75,20.89 75.92,19.72 R9.2 | 39.84,83.84 39.75,83.84 38.59,82.67 38.59,80.51 v39.82,79.27 | H1.24 41.08,83.86 41.08,80.53 v39.83,79.28
  Top 0.813: v27.14,73.8 27.14,77.09 v28.24,78.18 | 74.8,31 74.76,31.04 D2.P$1-CATHODE 61.45,31.02 v61.43,31.04 | v27.14,70 27.14,69.28 28.56,67.86 28.56,54.64 28.56,45.33 29.91,43.98 37.99,43.98 40.38,41.59 48.82,41.59 51.37,39.04 53.88,36.53 v53.88,32
  Top 1.27: C8.+ 80.27,34.07 77.8,34.07 D2.P$1-CATHODE | H1.22 H1.24
  Bottom 0.406: v74.75,27.82 v74.75,24.46 | v39.82,79.27 v39.83,79.28 v39.82,79.28 v39.82,79.27
  Bottom 0.813: v27.14,73.8 v27.14,70 | v53.88,32 54.84,31.04 v61.43,31.04 | v39.82,79.27 38.73,78.18 v28.24,78.18
ANT_CTL_H1-38
  Top 0.406: Q6.P$4-G 3.47,80.36 R24.1 3.46,82.65 6.46,85.65 10.04,85.65 10.47,86.08 12.01,87.62 12.01,88.79 13.54,90.32 13.8,90.32 58.81,90.32 58.81,85.86 58.81,85.15 H1.38
BATTERY_HEATER_-V_H1-6  (via drill 0.6)
  Top 0.305: Q3.P$8-D Q3.P$7-D Q3.P$6-D Q3.P$5-D
  Top 0.406: Q9.P$11-D 13.09,65.69 Q9.P$9-D | Q9.P$10-D 10.3,65.69 Q9.P$9-D | Q9.P$5-D Q9.P$6-D Q9.P$7-D Q9.P$8-D 11.69,67.47 Q9.P$9-D | H1.6 20.73,82.59 20.73,80.69 19.94,79.89 18.18,79.89 | 18.18,79.89 17.73,79.43 | Q3.P$10-D 17.26,65.69 Q3.P$9-D | Q3.P$11-D 20.05,65.69 Q3.P$9-D | Q3.P$6-D 19.29,67.72 Q3.P$9-D | 18.18,79.89 18.2,79.88 18.21,79.88 18.21,82.6 19.43,83.83 19.48,83.83
  Top 1.27: 18.21,79.88 v12.6,74.27 | v7.96,68.61 9.48,67.09 Q9.P$9-D Q3.P$9-D
  Bottom 1.27: v12.6,74.27 7.96,69.63 v7.96,68.61
BATTERY_THRMSTOR1_+V_H1-8  (via drill 0.6)
  Top 0.406: H1.8 23.3,82.56 v23.3,73.8 | v23.3,70 v23.3,53.55 23.3,37.04 23.29,37.03 R25.1 28.02,31.7 IC6.3 | IC9.P$13 39.85,52.02 v39.66,52.22
  Bottom 0.406: v23.3,73.8 v23.3,70 | v23.3,53.55 23.3,53.07 24.16,52.21 24.17,52.22 v39.66,52.22
BATTERY_THRMSTOR2_+V_H1-12  (via drill 0.6)
  Top 0.406: H1.12 25.84,82.62 v25.84,73.8 | v25.84,70 25.84,50.66 v25.84,48.17 25.84,42.04 27.04,40.83 36.46,40.83 38.21,39.08 R2.1 | 38.57,36.22 42.08,32.7 42.47,32.31 IC7.3 | 38.57,36.22 R2.1 | IC9.P$14 v38.7,51.38 | R2.1 38.57,36.22
  Bottom 0.406: v25.84,73.8 v25.84,70 | v38.7,51.38 38.19,51.38 33.83,47.02 31.2,47.02 26.99,47.02 v25.84,48.17
GNDA  (via drill 0.6)  (1 unrouted)
  Top 0.305: IC1.P$10 29.06,14.62 | IC1.P$7 27.79,13.12 27.79,11.41 | IC2.P$10 45.3,14.39 | IC2.P$7 44.22,12.89 44.22,11.17 | IC10.P$6 IC10.P$5 72,68.58 72.58,68.58 75.72,71.72 75.72,74.24 76.25,74.77 | R31.1 R32.1 77.28,74.66 72.36,74.66 | 79.49,21.97 Q2.P$1-S Q2.P$2-S Q2.P$3-S | IC11.2 71.41,75.15 71.9,74.66 72.36,74.66 | 72.36,74.66 67.83,74.66 C18.2 67.16,71.7 C17.2
  Top 0.406: C2.2 88.66,43.58 88.66,43.08 | 88.66,43.08 88.66,40.35 C1.2 | 88.65,47.49 C10.2 C3.2 88.67,57.36 v88.51,57.52 | 88.65,47.49 88.66,43.08 | IC4.P$4 88.63,47.47 88.65,47.49 | C1.2 | C4.- 88.51,62.81 | 29.06,14.62 29.76,15.32 29.76,18.18 | 29.76,18.18 R20.1 | 28.67,19.26 26.67,21.27 R21.1 19.94,21.27 19.92,21.29 R23.1 | 28.67,19.26 29.76,18.18 | 27.79,11.41 v30.21,11.41 | v28.23,18.38 28.67,19.26 | 45.3,14.39 46.15,15.24 46.15,18.31 | 46.15,18.31 R16.1 | 44.11,20.34 46.15,18.31 | R19.1 36.5,21.39 R17.1 43.07,21.39 44.11,20.34 | 44.22,11.17 v46.93,11.17 | C15.2 | C15.2 | v24.56,78.35 v24.56,73.8 | C14.2 49.38,64.92 | R5.1 82.33,38.85 88.68,38.85 C1.2 | H2.19 38.55,85.1 53.75,85.1 55.03,86.37 H2.33 | 88.69,17.66 C9.2 | 88.69,16.13 88.69,12.08 C6.2 88.68,7.62 C5.2 88.66,5.85 82.64,5.85 78.63,9.87 | IC3.P$4 88.67,16.11 88.69,16.13 | C9.2 88.69,16.13 | C9.2 C7.2 88.56,22.79 v88.56,26.31 | R8.1 78.63,9.87 | IC3.P$1 81.93,13.17 78.63,9.87 | 44.11,20.34 v45.83,20.34 | R10.1 45.21,26.38 C16.2 47.85,29.05 47.84,29.05 47.85,29.04 | 46.59,49.42 46.59,50.08 | 46.59,51.35 46.59,50.73 46.59,50.08 | 46.59,51.35 46.59,52.02 | 46.59,52.02 46.59,52.67 | 46.59,52.67 46.59,53.18 46.59,53.33 | IC9.P$3 46.59,48.77 | 46.59,47.48 IC9.P$20 43.11,47.48 R33.2 41.38,43.95 R12.1 34.8,50.54 R35.2 | 46.59,48.77 46.59,49.42 | IC9.P$4 46.59,49.42 | IC9.P$8 46.59,52.02 | 46.59,52.67 IC9.P$9 50.93,52.67 C20.2 C19.2 | IC9.P$10 46.59,53.33 | 30.82,26.15 R27.1 30.01,26.84 IC6.2 | 30.82,26.15 C15.2 | IC9.P$7 46.62,51.38 46.59,51.35 | 44.84,66.61 IC5.6 | 30.82,26.15 32.56,24.42 v43.7,24.42 44.91,25.62 R10.1 | v24.56,70 24.56,41.98 24.55,41.98 24.55,41.23 26.15,39.64 32.26,39.64 v34.15,37.75
  Top 0.406: v35.8,31.68 35.8,29.63 35.19,29.01 33.62,29.01 | 33.62,29.01 33.6,29 | Q9.P$3-S Q9.P$2-S Q9.P$1-S | Q3.P$3-S Q3.P$2-S Q3.P$1-S | 79.82,52.9 Q1.P$1-S Q1.P$2-S Q1.P$3-S | R32.1 76.25,74.77 v75.22,75.8 | 48.41,66.61 48.44,66.59 | 48.44,66.59 v49.33,65.69 49.38,65.65 49.38,64.92 | IC5.6 44.68,66.61 44.02,67.27 43.56,67.73 v43.56,70.56 | IC5.6 48.41,66.61 | 48.41,66.61 48.44,66.59 | v39.53,70.24 IC5.1 IC5.2 | v37.48,73.22 37.09,73.61 36.12,74.58 C24.2 | IC8.2 41.66,74.72 v43.46,74.72 44.34,75.6 C22.2 C23.2 | 46.59,48.77 46.59,47.48 | IC9.P$1 46.59,47.48 | IC12.2 47.68,56.31 47.6,56.31 v46.82,55.53 46.59,55.3 | 46.59,55.3 46.59,53.33 | 46.59,55.3 45.34,55.3 C25.2 C26.2 | 46.59,50.08 IC9.P$16 IC9.P$15 | IC7.2 44.53,26.75 R10.1 | 33.62,29.01 33.65,29.01 C15.2 | 49.38,64.92 49.38,64.9 49.38,64.92
  Top 0.813: R20.1 v31.33,20.39
  Top 1.27: C11.- 72.68,43.63 v72.68,46.31 | 88.51,62.81 v88.51,57.52 | H2.19 H2.17 | v88.56,26.31 v88.55,26.32 C8.- | C12.- 72.76,11.71 v72.76,14.3 | Q9.P$1-S 9.78,62.49 v11.06,61.22 | Q3.P$3-S 19.29,61.76 v18.55,61.01
  Top 1.422: v77.81,52.9 79.82,52.9 | v77.57,21.97 79.49,21.97
  Bottom 0.305: 23.24,76.89 23.23,76.89 22.87,76.89
  Bottom 0.406: 56.28,85.14 58.82,85.14 58.82,82.6 | 56.29,82.58 58.82,82.58 58.82,82.6 | 56.29,82.58 56.29,85.14 | 56.29,82.58 56.29,80 | 58.83,80 58.83,82.61 | 58.83,82.61 58.83,82.67 58.82,82.69 | 74.04,52.99 72.81,52.99 arc90 72.72,52.9 72.72,53.04 72.66,53.04 | v72.68,46.31 72.66,46.34 | v30.21,11.41 30.21,16.4 v28.23,18.38 | v46.93,11.17 46.93,20.34 | H1.10 23.3,82.62 23.3,79.6 v24.56,78.35 24.57,78.34 | v24.56,73.8 v24.56,70 | 58.82,82.6 58.83,82.61 | 58.83,80 46.96,80 47.59,79.36 47.59,79.24 | v49.33,65.69 47.59,67.43 47.59,79.24 | v39.53,70.24 40.44,71.15 42.96,71.15 v43.56,70.56 | 46.11,77.82 46.11,62.98 46.74,62.36 47.1,61.99 47.1,55.81 v46.82,55.53 | v43.7,24.42 47.09,24.42 49.35,26.68 49.35,63.75 46.85,66.25 46.85,77.82 46.11,77.82 | v34.15,37.75 35.8,36.09 v35.8,31.68 | 66.62,77.88 65.89,78.62 60.82,78.62 | 58.83,80 60.3,78.53 60.73,78.53 | 45.34,77.82 45.34,75.75 44.3,74.72 v43.46,74.72 42.72,74.72 41.22,73.22 v37.48,73.22 | 45.34,77.82 46.11,77.82 | 45.34,77.82 45.34,78.89 44.95,79.28 44.95,79.64 | 47.59,79.24 48.48,79.24 48.55,79.17 48.59,79.12 49.69,79.12 | 44.77,79.46 44.95,79.64 | 44.95,79.64 45.31,80 50.95,80 | v75.22,75.8 75.22,76.53 74.45,77.3 71.76,77.3 69.87,79.18
  Bottom 0.813: 49.69,79.12 49.69,71.58 51.46,69.81 51.46,25.74 46.93,21.22 46.93,20.34 v45.83,20.34 | v31.33,20.39 33.47,22.53 46.66,22.53 50.34,26.21 50.34,67.7 48.55,69.5 48.55,79.17
  Bottom 1.27: H2.33 56.28,85.14 | 72.66,46.34 72.66,53.04 | H2.51 80.13,84.16 80.13,80.85 78.47,79.18 73.21,79.18 | v88.56,26.31 81.91,26.31 v77.57,21.97 72.76,21.97 | v72.76,14.3 72.76,21.97 | 72.76,21.97 72.8,39.16 arc45 72.43,40.06 68.97,43.52 68.93,59.07 68.93,59.76 66.14,62.55 66.14,73.12 60.73,78.53 | 44.77,79.46 42.2,76.89 22.87,76.89 21.81,76.89 | 21.81,76.89 15.15,70.24 15.15,62.84 | 15.15,62.84 15.15,62.6 16.75,61.01 v18.55,61.01 | v11.06,61.22 13.53,61.22 15.15,62.84 | 21.81,76.89 21.36,76.89 H1.3 | 72.72,53.04 72.72,60.66 69.4,63.98 69.4,74.46 65.33,78.53 60.73,78.53 | 61.85,79.53 61.46,79.18 | 61.46,79.18 61.11,78.87 | 61.11,78.87 60.82,78.62 60.73,78.53 | 70.33,79.18 69.87,79.18 65.51,79.18 | 65.51,79.18 61.46,79.18 | H1.49 73.21,79.18 | 73.21,79.18 70.33,79.18 | H1.45 70.26,79.25 70.33,79.18 | H1.41 65.18,79.51 65.51,79.18 | H1.37 60.1,79.88 61.11,78.87
  Bottom 1.422: 72.72,52.9 v77.81,52.9 82.43,57.52 v88.51,57.52
N$1
  Top 0.406: IC4.P$5 83.96,52.96 Q1.P$4-G
N$2  (via drill 0.6)
  Top 0.305: IC1.P$3 IC1.P$4 | IC2.P$3 IC2.P$4
  Top 0.406: IC1.P$4 24.38,13.13 21.29,13.13 R22.2 | IC2.P$4 38.6,12.89 | 38.6,12.89 37.73,12.89 R18.2 | 39.14,12.9 38.6,12.9 38.6,12.89
  Top 1.422: R18.2 32.78,7.94 25.19,7.94 22.48,7.94 v21.34,9.08 19.91,10.51 R22.2
  Bottom 1.422: H2.2 11.22,85.77 7.47,85.77 1.53,79.83 1.53,71.15 1.53,64.94 7.9,58.57 10.59,55.88 15.34,55.88 18.75,52.47 18.75,47.79 18.75,43.91 17.87,43.03 17.14,42.3 17.14,40.13 17.14,36.35 18.48,35.01 18.84,34.65 18.84,17.23 18.84,11.58 v21.34,9.08
N$3  (via drill 0.6)
  Top 0.406: IC4.P$6 83.31,48.93 | C10.1 83.31,48.93 | L1.P$1 67.85,49.9 v74.73,49.9 | v79.97,49.92 80.97,48.93 81.35,48.93 82.01,48.93 | 82.01,48.93 83.31,48.93 | 67.58,42.38 C11.+ | D4.P$1-CATHODE | IC4.P$1 82.01,48.93
  Top 1.27: L1.P$1 67.58,42.38 | C11.+ D4.P$1-CATHODE
  Bottom 0.406: v74.73,49.9 74.73,49.92 v79.97,49.92
N$7  (via drill 0.6)
  Top 0.406: IC4.P$3 83.31,46.14 v84.26,45.19 | v80.74,45.19 R5.2 78.78,45.21 R1.1
  Bottom 0.406: v84.26,45.19 v80.74,45.19
N$8
  Top 0.406: C1.1 R4.1
N$9
  Top 0.406: C2.1 R4.2 82.66,44.36 IC4.P$2
N$10
  Top 0.406: IC4.P$8 80.9,51.2 76.86,51.2 76.3,51.76 76.3,57.94 | Q1.P$5-D Q1.P$6-D | Q1.P$6-D Q1.P$7-D | Q1.P$7-D Q1.P$8-D | Q1.P$10-D 80.53,55.24 Q1.P$9-D | Q1.P$11-D 83.32,55.24 Q1.P$9-D | Q1.P$9-D 80.95,57.6 80.95,57.94 81.29,58.28 Q1.P$7-D | Q1.P$6-D 82.54,58.94 81.3,58.94 81.3,58.92 Q1.P$7-D | Q1.P$7-D 81.3,58.92
  Top 1.27: 80.95,57.94 76.3,57.94 L1.P$2 | D1.P$2-ANODE 79.25,59.68 Q1.P$8-D
N$12
  Top 0.406: Q6.P$5-D Q6.P$6-D Q6.P$7-D | Q6.P$7-D Q6.P$8-D | Q6.P$11-D 7.17,78.21 Q6.P$9-D | Q6.P$10-D 9.96,78.21 Q6.P$9-D | Q6.P$7-D 9.2,76.19 Q6.P$9-D
  Top 1.676: H1.1 14.38,78.93 12.27,76.82 Q6.P$9-D
N$14
  Top 0.406: 81.63,26.59 81.63,26.53 81.63,25.38 Q2.P$9-D 81.58,23.93 | IC3.P$8 80.24,20.41 77.51,20.41 76.33,21.59 76.33,26.53 | Q2.P$8-D Q2.P$7-D | Q2.P$7-D Q2.P$6-D | Q2.P$5-D Q2.P$6-D | Q2.P$6-D 82.22,27.18 81.63,26.59 | 81.63,26.59 81.63,26.73 Q2.P$7-D | Q2.P$10-D 81.56,23.93 | 81.56,23.93 81.56,25.33 | Q2.P$11-D 81.58,23.93 | 81.58,23.93 81.56,23.93
  Top 1.27: L2.P$2 76.33,26.53 81.63,26.53
  Top 1.422: D2.P$2-ANODE 79.15,28.14 Q2.P$8-D
N$16
  Top 0.406: IC3.P$5 83.88,21.59 Q2.P$4-G
N$17  (via drill 0.6)
  Top 0.406: IC3.P$7 v82.58,20.08 | v85.18,22.68 85.21,22.65 86.82,22.65 C7.1
  Bottom 0.406: v82.58,20.08 v85.18,22.68
N$18
  Top 0.406: C20.1 50.88,50.73 IC9.P$6 IC9.P$5 | 53.44,50.92 C19.1 | IC12.5 49.18,55.36 49.99,54.55 53.76,54.55 54.36,53.95 54.36,52.41 54.36,51.4 54.07,51.11 53.88,50.92 C19.1 | C19.1 C20.1 | IC9.P$2 50.47,48.12 50.93,48.59 51.07,48.73 C20.1
N$19  (via drill 0.6)
  Top 0.406: R9.1 78.72,13.04 R8.2 79.23,14.01 v80.54,14.01 | IC3.P$3 83.23,15.16 v84.37,14.01
  Bottom 0.406: v84.37,14.01 v80.54,14.01
N$20
  Top 0.406: R7.1 C5.1
N$21
  Top 0.406: C6.1 R7.2 82.58,11.99 IC3.P$2
N$22
  Bottom 0.406: H1.31 52.48,81.35 52.49,81.3
  Bottom 1.27: 52.49,81.3 H1.30 H2.31
  Bottom 1.422: H1.33 H1.31
N$23  (via drill 0.6)
  Top 0.406: IC3.P$6 83.23,17.47 | 83.23,17.47 C9.1 | L2.P$1 v74.84,18.23 | v79.72,18.23 80.47,17.47 83.23,17.47
  Top 1.27: L2.P$1 C12.+ D3.P$1-CATHODE
  Bottom 0.406: v74.84,18.23 v79.72,18.23
N$24
  Top 0.406: 35.34,54.06 R35.1 34.44,53.88 | R36.2 33.06,55.26 34.44,53.88 | IC9.P$11 34.99,53.33 34.44,53.88
N$25  (via drill 0.6)
  Top 0.305: IC2.P$2 v39.07,13.89
  Top 0.406: v40.45,18.58 R17.2
  Bottom 0.406: v39.07,13.89 39.07,17.2 v40.45,18.58
N$26
  Top 0.406: Q8.P$11-D 56.03,16.57 Q8.P$9-D | Q8.P$10-D 56.03,19.36 Q8.P$9-D | Q8.P$6-D 58.06,17.33 Q8.P$9-D
  Top 1.27: Q8.P$5-D Q8.P$6-D | Q8.P$8-D Q8.P$7-D Q8.P$6-D | Q8.P$6-D D3.P$2-ANODE
N$27  (via drill 0.6)
  Top 0.305: IC2.P$8 44.55,13.39 v45.23,12.71 | 40.88,16.46 IC2.P$1
  Top 0.406: 36.51,18.58 R19.2 | v45.23,16.52 40.88,16.52 40.88,16.46 40.91,16.44 40.94,16.44 38.8,18.58 36.51,18.58 | 36.51,18.58 R18.1
  Bottom 0.406: v45.23,12.71 v45.23,16.52
N$28
  Top 0.305: 47.85,13.89 IC2.P$9
  Top 0.406: R16.2 47.85,13.89
N$29  (via drill 0.6)
  Top 0.305: v23.18,14.11 IC1.P$2
  Top 0.406: R21.2 24.38,18.46 v23.18,19.66 | IC1.P$2
  Bottom 0.406: v23.18,19.66 v23.18,14.12 v23.18,14.11
N$30  (via drill 0.6)
  Top 0.305: IC10.P$10 65.67,66.58 65.04,65.96 65.04,63.76
  Top 0.406: C4.+ 82.16,62.83 | D1.P$1-CATHODE v74.85,59.83 v74.86,59.83 | v74.86,56.31 74.86,51.78 74.84,51.76 75.98,50.62 R1.2 | 65.04,63.76 R37.2
  Top 1.27: 82.16,62.83 79.76,64.64 76.77,64.64 D1.P$1-CATHODE
  Top 1.422: D1.P$1-CATHODE 66.73,62.07 R37.2
  Bottom 0.406: v74.86,59.83 v74.86,56.31
N$31  (via drill 0.6)
  Top 0.305: IC1.P$1 24.38,16.16 24.38,16.46 | IC1.P$8 28.13,13.62
  Top 0.406: R22.1 R23.2 | R23.2 | 24.38,16.46 22.77,18.07 19.99,18.07 R23.2 | 28.13,13.62 v28.78,12.97 | v28.78,16.18 24.4,16.18 24.38,16.16
  Bottom 0.406: v28.78,12.97 v28.78,16.18
N$32
  Top 0.305: IC1.P$9 31.33,14.12
  Top 0.406: 31.33,14.12 R20.2
N$33  (via drill 0.6)
  Top 0.406: v45.1,39.83 46.32,38.62 46.32,33.98 46.32,33.15 IC7.1 | Q3.P$4-G 21.79,62.33 21.79,42.08 v21.79,40.63
  Bottom 0.406: v45.1,39.83 24.04,39.83 22.59,39.83 v21.79,40.63
N$35
  Top 0.406: R3.1 42.08,28.83 42.08,28.89 42.11,28.92 | R10.2 42.11,28.92 | 42.11,28.92 42.11,29.02 42.8,29.71 IC7.4
N$37  (via drill 0.6)
  Top 0.406: R33.1 47.13,43.95 47.84,44.66 48.33,45.15 48.38,45.15 | v47.75,45.79 48.38,45.15 | 48.38,45.15 49.59,43.95 R34.2 | IC9.P$12 44.76,52.67 44.97,52.46 45.09,52.34 v45.09,51.63
  Bottom 0.406: v45.09,51.63 45.09,48.44 v47.75,45.79
N$38
  Top 0.406: 49.65,69.84 C13.2 | R15.1 49.66,69.84 C13.2 | C13.2 48.19,69.83 47.84,69.48 47.51,69.15 IC5.8
N$39
  Top 0.406: Q4.P$10-D 61.23,35.74 Q4.P$9-D | Q4.P$11-D 64.03,35.74 Q4.P$9-D | Q4.P$7-D 62,37.77 Q4.P$9-D | Q4.P$5-D Q4.P$6-D Q4.P$7-D | Q4.P$7-D Q4.P$8-D
  Top 1.27: D4.P$2-ANODE 60.15,40 Q4.P$8-D
N$40
  Top 0.406: 49.65,67.88 C13.1 | R14.1 52.41,65.17 C13.1 | C13.1 49.59,67.88 IC5.7
N$43  (via drill 0.6)
  Top 0.254: R14.2 57.51,64.08
  Top 0.305: R13.2 58.47,65.42 59.97,66.92 59.97,72.51 61.66,74.21 63.35,75.89 C18.1 67.26,75.99 IC11.3 70.45,76.72 70.81,77.08 72.03,77.08 72.36,76.75 IC11.1
  Top 0.406: 57.69,53.89 57.56,54.01 57.55,54.09 | R24.2 3.54,77.54 3.54,74.76 v6.37,71.93 | 57.57,59.78 57.51,59.84 57.51,60.24 57.51,64.08 57.57,64.08 R13.2 | H1.4 15.64,85.14 13.06,85.14 | 16.9,83.85 15.65,82.6 13.54,82.6 | 13.54,82.6 13.54,82.63 | 13.54,82.6 13.53,82.6 | 10.48,82.55 v10.52,82.6 | 9.19,80.36 9.19,80.74 | Q6.P$3-S 9.19,80.36 | 9.19,80.36 Q6.P$2-S | Q6.P$2-S Q6.P$1-S | 9.19,81.26 9.19,80.37 Q6.P$2-S | Q8.P$2-S Q8.P$3-S | 57.58,35.67 57.95,35.29 57.56,34.91 57.56,26.75 | Q4.P$1-S Q4.P$2-S Q4.P$3-S 63.26,32.26 63.52,32.01 68.09,32.01 R39.2 | 51.87,21.06 51.87,14.1 53.04,12.93 53.05,12.93 R6.2
  Top 0.813: 13.06,85.14 v10.52,82.6 13.53,82.6 | Q8.P$1-S
  Top 1.016: Q8.P$2-S Q8.P$1-S | Q8.P$1-S 53.88,23.07
  Top 1.676: 57.51,60.24 35.68,60.24 32.9,63.02 32.9,69.46 30.43,71.93 v6.37,71.93 | R13.2 57.55,65.42 57.55,54.09 | 57.56,54.01 57.56,26.75 53.88,23.07 51.87,21.06 | 9.19,81.26 v10.52,82.6 | Q4.P$1-S 59.65,33.6 57.95,35.29
  Bottom 1.676: v6.37,71.93 5.63,72.68 5.63,76.12 5.63,77.72 9.61,81.7 9.62,81.7 v10.52,82.6
N$45  (via drill 0.6)
  Top 0.406: Q9.P$4-G 20.22,56.93 20.22,52.55 20.22,40.98 20.22,39.01 20.43,38.8 v20.97,38.26 | v28.15,37.95 29.99,36.11 30.96,35.14 IC6.1
  Bottom 0.406: v28.15,37.95 23.25,37.95 21.28,37.95 v20.97,38.26
N$46
  Top 0.254: R15.2 57.57,69.84 57.57,69.85
  Top 0.406: 57.57,78.87 57.57,79.06
  Top 1.676: R13.1 57.57,69.85 57.57,79.06 H1.35 | H2.52 80.82,86 80.82,80.91 78.78,78.87 57.57,78.87
N$47  (via drill 0.6)
  Top 0.305: IC10.P$1 71.38,66.58 72.34,65.62 74.1,65.62 v74.47,65.99 | IC11.5 72.36,72.61 73.48,71.49 v73.45,71.46 C17.1
  Bottom 0.305: v74.47,65.99 74.47,69.4 73.45,70.42 v73.45,71.46
N$48
  Top 0.406: IC9.P$17 42.96,49.42 42.45,49.94 39.52,49.94 R12.2
N$51
  Top 0.305: R30.2 R29.2 77.34,67.08 IC10.P$2
N$53
  Top 0.406: 27.91,26.16 R27.2 27.9,28.11 | R26.1 25.26,29 27.01,29 27.61,28.4 27.9,28.11 | IC6.4 28.07,28.11 27.9,28.11
N$54
  Top 0.305: R32.2 R29.1 75,69.83 73.25,68.08 IC10.P$4
N$55
  Top 0.305: R31.2 R30.1 80.19,69.83 78.78,68.42 75.18,68.42 74.33,67.58 IC10.P$3
N$56  (via drill 0.6)
  Top 0.406: IC4.P$7 v82.66,51.43 | v85.24,53.59 C3.1
  Bottom 0.406: v82.66,51.43 84.8,53.58 v85.24,53.59
N$57  (via drill 0.6)
  Top 0.305: IC10.P$7 67.47,68.08 67.88,67.67 67.88,65.44 69.12,64.2 v73.16,64.2 | v76.27,37.21 70.5,37.21 R39.1
  Top 0.406: Q4.P$4-G 65.92,33.6 68.12,35.8 R39.1
  Bottom 0.305: v73.16,64.2 84.62,64.2 89.61,59.21 89.61,44.01 82.81,37.21 v76.27,37.21
Q6_3V3_H2-36  (via drill 0.6)
  Top 0.406: v84.17,83.3 R38.2 | 47.26,63.76 C14.1 45.89,65.34 IC5.5 43.86,65.34 v42.59,66.61 42.59,69.94 40.1,72.43 40.1,76.02 38.04,78.08 37.09,78.08 v35.98,79.19
  Bottom 0.406: v35.98,79.19 35.98,87.04 36.6,87.67 42.84,87.67 43.57,88.4 43.57,89.5 44.88,90.8 55.7,90.8 H2.36 59.01,90.38 78.58,90.38 79.22,89.74 79.22,88.25 v84.17,83.3
Q6_GPIO_10_H1-50  (via drill 0.6)
  Top 0.305: v71.11,69.77 65.43,69.77 64.95,69.29 64.95,67.93 65.3,67.58 IC10.P$8
  Top 0.406: v84.17,75.45 R38.1
  Bottom 0.305: v71.11,69.77 71.94,70.59 71.94,71.64 71.94,72.25 73.22,73.53 74.24,74.55 81.83,74.55
  Bottom 0.406: 81.82,74.6 81.82,84.34 78.52,87.65 77.09,87.65 76.64,87.2 76.64,85.16 H1.50 | 81.82,74.6 83.31,74.6 v84.17,75.45 | 81.83,74.55 81.83,74.58 81.82,74.6
Q6_I2C_SCL_1_H2-20  (via drill 0.6)
  Top 0.406: IC9.P$19 42.88,48.13 42.73,48.13 41.79,47.19 41.32,47.19 v40.84,47.67 | H2.20 35.98,87.67 31.71,87.67 30.9,86.86 30.9,75.5 35.91,70.49 v35.91,66.49 37.06,65.34 IC5.4
  Bottom 0.406: v35.91,66.49 35.91,64.87 38.83,61.95 40.84,59.94 v40.84,47.67
Q6_I2C_SDA_1_H2-18  (via drill 0.6)
  Top 0.406: v32.49,79.06 32.49,75.36 37.29,70.56 v37.29,67.65 38.33,66.61 IC5.3 | v41.97,48.84 41.97,48.77 IC9.P$18
  Bottom 0.406: v32.49,79.06 30.89,80.66 30.89,89.6 31.64,90.35 33.3,90.35 H2.18 | v37.29,67.65 37.29,65.32 39.93,62.68 41.97,60.64 v41.97,48.84
SOLAR_PANEL_1_3_H1-29  (via drill 0.6)
  Top 0.254: IC2.P$5
  Top 0.305: IC2.P$5 40.88,11.94 | IC2.P$6 43.48,11.82
  Top 0.406: R34.1 52.4,44.12 52.41,44.11 55.51,44.11 | 43.48,11.82 42.36,10.71 42.34,10.69 42.34,10.2 | 40.88,11.94 42.17,10.64 | 42.17,10.64 42.17,10.37 | 42.17,10.64 42.19,10.63 42.36,10.63
  Top 0.813: 43.06,9.48 42.36,10.18 42.36,10.63 42.36,10.71
  Top 1.016: 43.06,9.48 47.92,9.48 49.86,11.42 49.86,21.91 55.51,27.56 55.51,44.11 55.51,48.49 v55.51,58.2 | v51.14,75.81 51.14,80.13 H1.29
  Bottom 1.016: v51.14,75.81 51.14,72.2 55.51,67.83 v55.51,58.2
SOLAR_PANEL_2_4_H1-2  (via drill 0.6)
  Top 0.305: IC1.P$6
  Top 0.406: IC1.P$6 26.98,11.98 25.8,10.79 | 25.8,10.79 25.69,10.69 | IC1.P$5 24.38,12.2 25.8,10.79 | R36.1 31.5,51.06 v30.79,50.36
  Top 1.016: v23.22,9.94 24.95,9.94 25.69,10.69
  Bottom 0.406: v30.79,50.36 22.24,50.36 21.28,49.4 21.09,49.4
  Bottom 1.016: v23.22,9.94 21.06,12.1 21.06,35.97 19.39,37.64 19.39,40.83 19.83,41.27 21.09,42.53 21.09,44.85 21.09,49.4 21.09,54.44 20.15,55.38 17.75,57.78 11.59,57.78 3.49,65.88 3.49,67.75 3.49,79.18 5.45,81.14 8.45,84.14 12.49,84.14 14.11,84.14 H1.2
THERMAL1  (via drill 0.6, 3.3)
  other vias: 82.75,88.85 9.07,88.85 5.26,3.13 85.27,3.12 11,5 18,3 25,5 32,3 39,5 46,3 53,5 60,3 67,5 25.96,12.98 25.37,14.26 41.88,14.05 42.47,12.75
  pour Route15: -0.02,91.85 -0.02,-0.03 90.51,-0.03 90.51,91.85
  pour Route2: -0.02,91.85 -0.02,-0.04 90.53,-0.04 90.53,91.85
(copper drawn outside any net)
  shapes: Bottom area x1, Top area x13